# EAGLE design keyBoard_B (EAGLE 6.3)
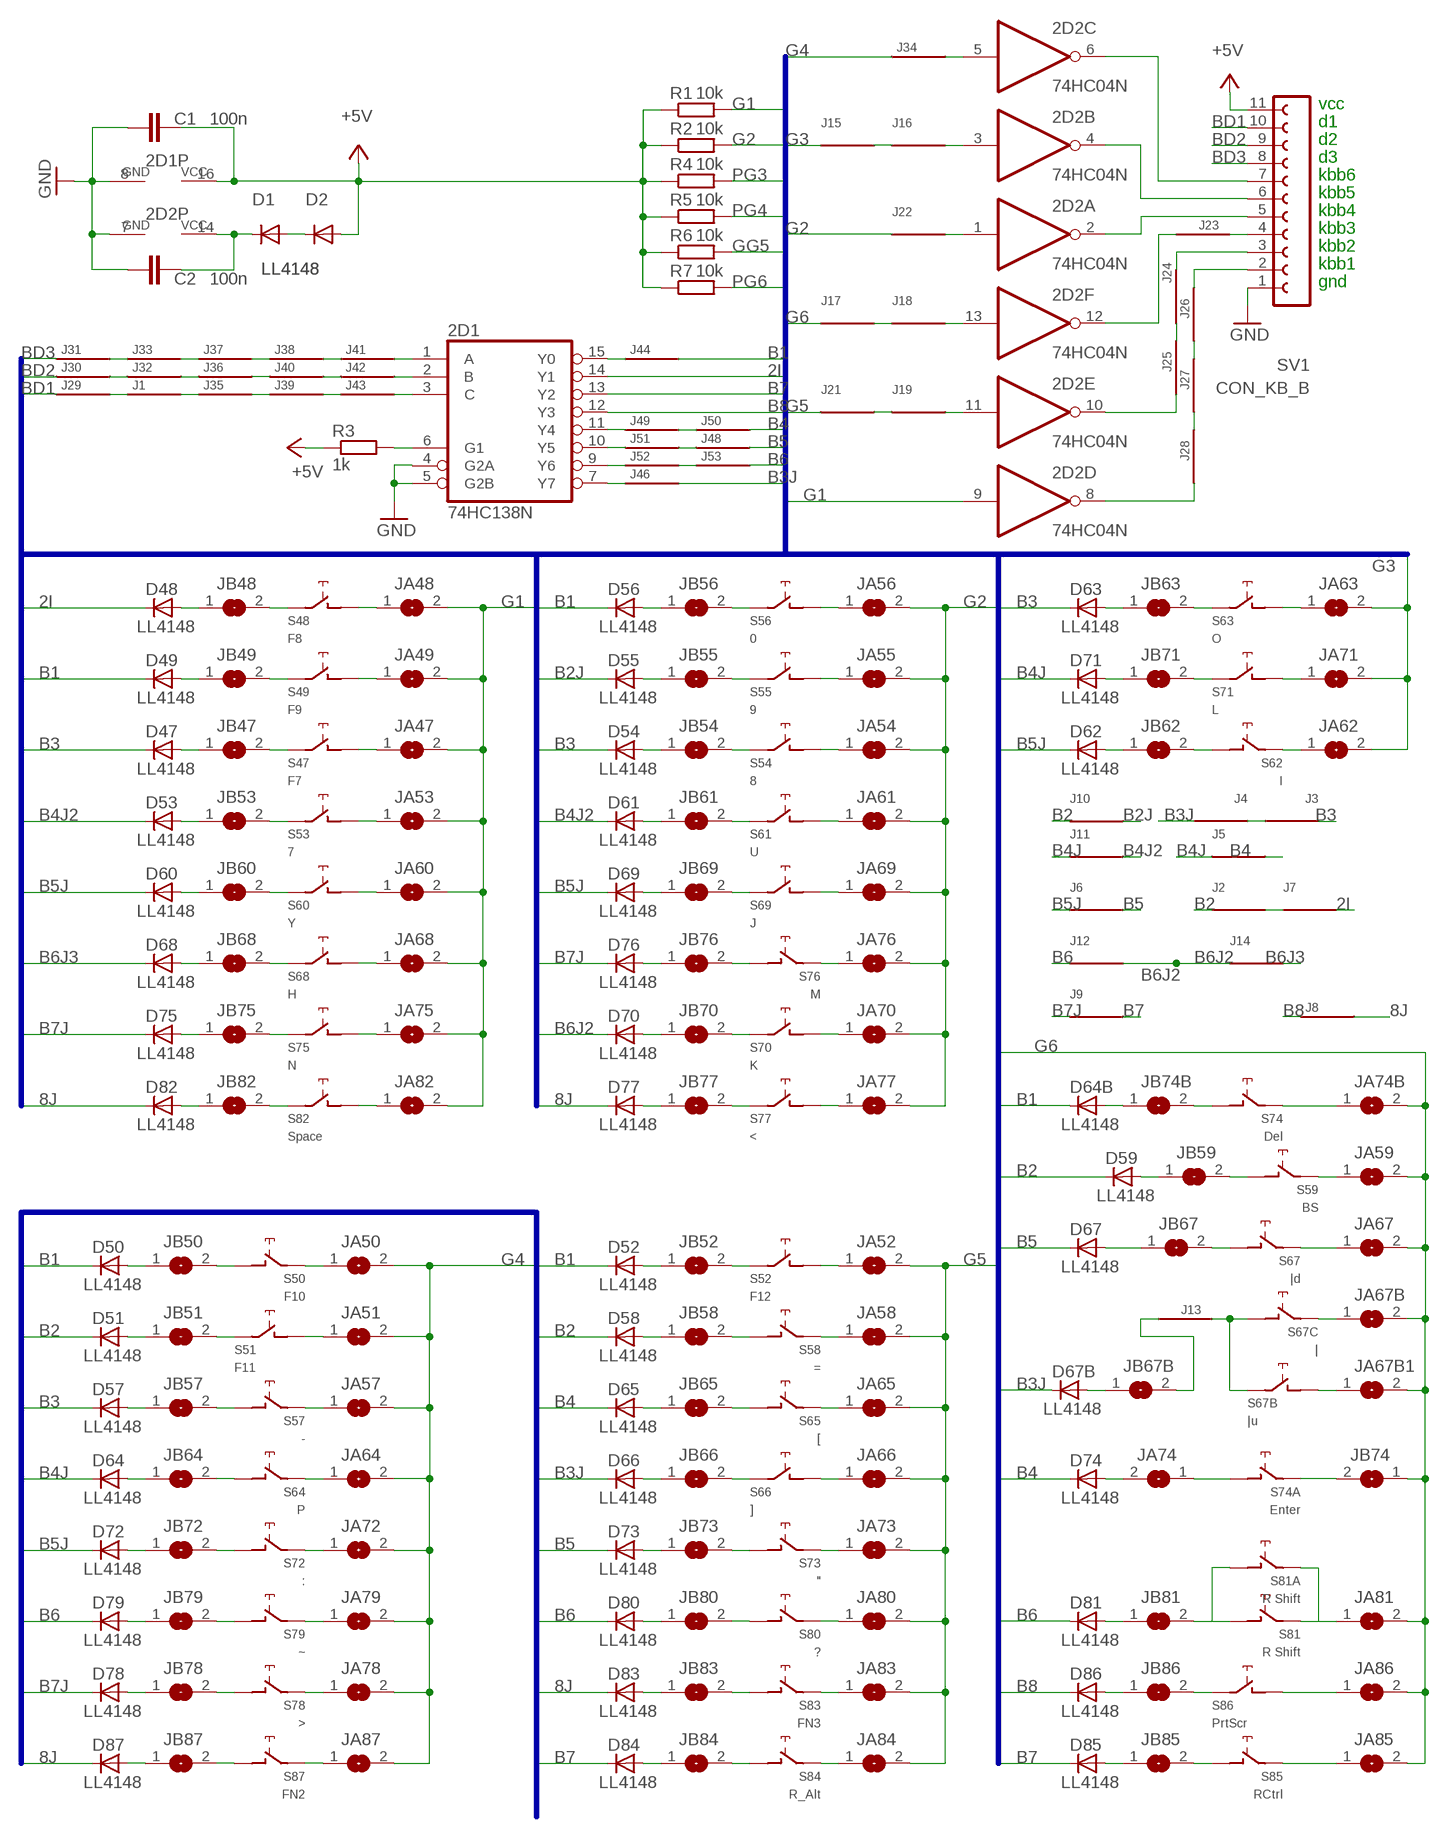
[diagram p0: schematic, sheet 1]

## Parts
2D1  74HC138N  74AC138N  [DIL16]
2D2  74HC04N  74ALS04N  [DIL14]
C1  100n  C-EUC0805  [C0805]
C2  100n  C-EUC1206  [C1206]
D1  LL4148  [SOD80C]
D2  LL4148  [SOD80C]
D47  LL4148  [SOD80C]
D48  LL4148  [SOD80C]
D49  LL4148  [SOD80C]
D50  LL4148  [SOD80C]
D51  LL4148  [SOD80C]
D52  LL4148  [SOD80C]
D53  LL4148  [SOD80C]
D54  LL4148  [SOD80C]
D55  LL4148  [SOD80C]
D56  LL4148  [SOD80C]
D57  LL4148  [SOD80C]
D58  LL4148  [SOD80C]
D59  LL4148  [SOD80C]
D60  LL4148  [SOD80C]
D61  LL4148  [SOD80C]
D62  LL4148  [SOD80C]
D63  LL4148  [SOD80C]
D64  LL4148  [SOD80C]
D64B  LL4148  [SOD80C]
D65  LL4148  [SOD80C]
D66  LL4148  [SOD80C]
D67  LL4148  [SOD80C]
D67B  LL4148  [SOD80C]
D68  LL4148  [SOD80C]
D69  LL4148  [SOD80C]
D70  LL4148  [SOD80C]
D71  LL4148  [SOD80C]
D72  LL4148  [SOD80C]
D73  LL4148  [SOD80C]
D74  LL4148  [SOD80C]
D75  LL4148  [SOD80C]
D76  LL4148  [SOD80C]
D77  LL4148  [SOD80C]
D78  LL4148  [SOD80C]
D79  LL4148  [SOD80C]
D80  LL4148  [SOD80C]
D81  LL4148  [SOD80C]
D82  LL4148  [SOD80C]
D83  LL4148  [SOD80C]
D84  LL4148  [SOD80C]
D85  LL4148  [SOD80C]
D86  LL4148  [SOD80C]
D87  LL4148  [SOD80C]
J1  J  [R1206W]
J2  J  [R1206W]
J3  J  [R1206W]
J4  J  [R1206W]
J5  J  [R1206W]
J6  J  [R1206W]
J7  J  [R1206W]
J8  J  [R1206W]
J9  J  [R1206W]
J10  J  [R1206W]
J11  J  [R1206W]
J12  J  [R1206W]
J13  J  [R1206W]
J14  J  [R1206W]
J15  J  [R1206W]
J16  J  [R1206W]
J17  J  [R1206W]
J18  J  [R1206W]
J19  J  [R1206W]
J21  J  [R1206W]
J22  J  [R1206W]
J23  J  [R1206W]
J24  J  [R1206W]
J25  J  [R1206W]
J26  J  [R1206W]
J27  J  [R1206W]
J28  J  [R1206W]
J29  J  [R1206W]
J30  J  [R1206W]
J31  J  [R1206W]
J32  J  [R1206W]
J33  J  [R1206W]
J34  J  [R1206W]
J35  J  [R1206W]
J36  J  [R1206W]
J37  J  [R1206W]
J38  J  [R1206W]
J39  J  [R1206W]
J40  J  [R1206W]
J41  J  [R1206W]
J42  J  [R1206W]
J43  J  [R1206W]
J44  J  [R1206W]
J46  J  [R1206W]
J48  J  [R1206W]
J49  J  [R1206W]
J50  J  [R1206W]
J51  J  [R1206W]
J52  J  [R1206W]
J53  J  [R1206W]
JA47  SJ  [SJ]
JA48  SJ  [SJ]
JA49  SJ  [SJ]
JA50  SJ  [SJ]
JA51  SJ  [SJ]
JA52  SJ  [SJ]
JA53  SJ  [SJ]
JA54  SJ  [SJ]
JA55  SJ  [SJ]
JA56  SJ  [SJ]
JA57  SJ  [SJ]
JA58  SJ  [SJ]
JA59  SJ  [SJ]
JA60  SJ  [SJ]
JA61  SJ  [SJ]
JA62  SJ  [SJ]
JA63  SJ  [SJ]
JA64  SJ  [SJ]
JA65  SJ  [SJ]
JA66  SJ  [SJ]
JA67  SJ  [SJ]
JA67B  SJ  [SJ]
JA67B1  SJ  [SJ]
JA68  SJ  [SJ]
JA69  SJ  [SJ]
JA70  SJ  [SJ]
JA71  SJ  [SJ]
JA72  SJ  [SJ]
JA73  SJ  [SJ]
JA74  SJ  [SJ]
JA74B  SJ  [SJ]
JA75  SJ  [SJ]
JA76  SJ  [SJ]
JA77  SJ  [SJ]
JA78  SJ  [SJ]
JA79  SJ  [SJ]
JA80  SJ  [SJ]
JA81  SJ  [SJ]
JA82  SJ  [SJ]
JA83  SJ  [SJ]
JA84  SJ  [SJ]
JA85  SJ  [SJ]
JA86  SJ  [SJ]
JA87  SJ  [SJ]
JB47  SJ  [SJ]
JB48  SJ  [SJ]
JB49  SJ  [SJ]
JB50  SJ  [SJ]
JB51  SJ  [SJ]
JB52  SJ  [SJ]
JB53  SJ  [SJ]
JB54  SJ  [SJ]
JB55  SJ  [SJ]
JB56  SJ  [SJ]
JB57  SJ  [SJ]
JB58  SJ  [SJ]
JB59  SJ  [SJ]
JB60  SJ  [SJ]
JB61  SJ  [SJ]
JB62  SJ  [SJ]
JB63  SJ  [SJ]
JB64  SJ  [SJ]
JB65  SJ  [SJ]
JB66  SJ  [SJ]
JB67  SJ  [SJ]
JB67B  SJ  [SJ]
JB68  SJ  [SJ]
JB69  SJ  [SJ]
JB70  SJ  [SJ]
JB71  SJ  [SJ]
JB72  SJ  [SJ]
JB73  SJ  [SJ]
JB74  SJ  [SJ]
JB74B  SJ  [SJ]
JB75  SJ  [SJ]
JB76  SJ  [SJ]
JB77  SJ  [SJ]
JB78  SJ  [SJ]
JB79  SJ  [SJ]
JB80  SJ  [SJ]
JB81  SJ  [SJ]
JB82  SJ  [SJ]
JB83  SJ  [SJ]
JB84  SJ  [SJ]
JB85  SJ  [SJ]
JB86  SJ  [SJ]
JB87  SJ  [SJ]
R1  10k  R-EU_R0805  [R0805]
R2  10k  R-EU_R0805  [R0805]
R3  1k  R-EU_R0805  [R0805]
R4  10k  R-EU_R0805  [R0805]
R5  10k  R-EU_R1206W  [R1206W]
R6  10k  R-EU_R0805  [R0805]
R7  10k  R-EU_R0805  [R0805]
S47  F7  CHERRY-MX-4P  [CHERRY-MX-4P]
S48  F8  CHERRY-MX-4P  [CHERRY-MX-4P]
S49  F9  CHERRY-MX-4P  [CHERRY-MX-4P]
S50  F10  CHERRY-MX-4P  [CHERRY-MX-4P]
S51  F11  CHERRY-MX-4P  [CHERRY-MX-4P]
S52  F12  CHERRY-MX-4P  [CHERRY-MX-4P]
S53  7  CHERRY-MX-4P  [CHERRY-MX-4P]
S54  8  CHERRY-MX-4P  [CHERRY-MX-4P]
S55  9  CHERRY-MX-4P  [CHERRY-MX-4P]
S56  0  CHERRY-MX-4P  [CHERRY-MX-4P]
S57  -  CHERRY-MX-4P  [CHERRY-MX-4P]
S58  =  CHERRY-MX-4P  [CHERRY-MX-4P]
S59  BS  CHERRY-MX-4P  [CHERRY-MX-4P]
S60  Y  CHERRY-MX-4P  [CHERRY-MX-4P]
S61  U  CHERRY-MX-4P  [CHERRY-MX-4P]
S62  I  CHERRY-MX-4P  [CHERRY-MX-4P]
S63  O  CHERRY-MX-4P  [CHERRY-MX-4P]
S64  P  CHERRY-MX-4P  [CHERRY-MX-4P]
S65  [  CHERRY-MX-4P  [CHERRY-MX-4P]
S66  ]  CHERRY-MX-4P  [CHERRY-MX-4P]
S67  |d  CHERRY-MX-4P  [CHERRY-MX-4P]
S67B  |u  CHERRY-MX  [CHERRY-MX]
S67C  |  CHERRY-MX-4P  [CHERRY-MX-4P]
S68  H  CHERRY-MX-4P  [CHERRY-MX-4P]
S69  J  CHERRY-MX-4P  [CHERRY-MX-4P]
S70  K  CHERRY-MX-4P  [CHERRY-MX-4P]
S71  L  CHERRY-MX-4P  [CHERRY-MX-4P]
S72  :  CHERRY-MX-4P  [CHERRY-MX-4P]
S73  "  CHERRY-MX-4P  [CHERRY-MX-4P]
S74  Del  CHERRY-MX-4P  [CHERRY-MX-4P]
S74A  Enter  CHERRY-MX-4P  [CHERRY-MX-4P]
S75  N  CHERRY-MX-4P  [CHERRY-MX-4P]
S76  M  CHERRY-MX-4P  [CHERRY-MX-4P]
S77  <  CHERRY-MX-4P  [CHERRY-MX-4P]
S78  >  CHERRY-MX-4P  [CHERRY-MX-4P]
S79  ~  CHERRY-MX-4P  [CHERRY-MX-4P]
S80  ?  CHERRY-MX-4P  [CHERRY-MX-4P]
S81  R Shift  CHERRY-MX-4P  [CHERRY-MX-4P]
S81A  R Shift  CHERRY-MX-4P  [CHERRY-MX-4P]
S82  Space  CHERRY-MX-4P  [CHERRY-MX-4P]
S83  FN3  CHERRY-MX-4P  [CHERRY-MX-4P]
S84  R_Alt  CHERRY-MX-4P  [CHERRY-MX-4P]
S85  RCtrl  CHERRY-MX-4P  [CHERRY-MX-4P]
S86  PrtScr  CHERRY-MX-4P  [CHERRY-MX-4P]
S87  FN2  CHERRY-MX-4P  [CHERRY-MX-4P]
SV1  CON_KB_B  FE12-1  [FE12]

## Nets
2I: 2D1.14(Y1) D48.C J7.1
8J: D77.C D82.C D83.C D87.C J8.1
+3VD: 2D2.14(P:VCC) C2.1 D1.C
+5V_B: 2D1.16(VCC) C1.1 D2.A R1.1 R2.1 R3.1 R4.1 R5.1 R6.1 R7.1 SV1.11 ; supply symbol labelled +5V
B1: D49.C D50.C D52.C D56.C D64B.C J44.1
B2: D51.C D58.C D59.C J2.2 J10.2
B2J: D55.C J10.1
B3: D47.C D54.C D57.C D63.C J3.2
B3J: D66.C D67B.C J4.1 J46.1
B4: D65.C D74.C J5.1 J50.1
B4J: D64.C D71.C J5.2 J11.2
B4J2: D53.C D61.C J11.1
B5: D67.C D73.C J6.1 J48.1
B5J: D60.C D62.C D69.C D72.C J6.2
B6: D79.C D80.C D81.C J12.2 J53.1
B6J2: D70.C J12.1 J14.2
B6J3: D68.C J14.1
B7: 2D1.13(Y2) D84.C D85.C J9.1
B7J: D75.C D76.C D78.C J9.2
B8: 2D1.12(Y3) D86.C J8.2
BD1: J29.2 SV1.10
BD2: J30.2 SV1.9
BD3: J31.2 SV1.8
G1: 2D2.9(D:I) JA47.2 JA48.2 JA49.2 JA53.2 JA60.2 JA68.2 JA75.2 JA82.2 R1.2
G2: J22.2 JA54.2 JA55.2 JA56.2 JA61.2 JA69.2 JA70.2 JA76.2 JA77.2 R2.2
G3: J15.2 JA62.2 JA63.2 JA71.2
G4: J34.2 JA50.2 JA51.2 JA57.2 JA64.2 JA72.2 JA78.2 JA79.2 JA87.2
G5: J21.2 JA52.2 JA58.2 JA65.2 JA66.2 JA73.2 JA80.2 JA83.2 JA84.2
G6: J17.2 JA59.2 JA67.2 JA67B1.2 JA67B.2 JA74B.2 JA81.2 JA85.2 JA86.2 JB74.1
GG5: 2D2.11(E:I) J19.1 R6.2
GND_B: 2D1.4(G2A) 2D1.5(G2B) 2D1.8(GND) 2D2.7(P:GND) C1.2 C2.2 SV1.1 ; supply symbol labelled GND
N$1: 2D2.1(A:I) J22.1
N$2: J23.1 SV1.4
N$3: 2D2.10(E:O) J25.2
N$4: J24.1 SV1.3
N$5: J24.2 J25.1
N$6: J26.2 J27.1
N$7: J26.1 SV1.2
N$8: J27.2 J28.1
N$10: D1.A D2.C
N$11: J1.2 J29.1
N$12: J30.1 J32.2
N$13: J31.1 J33.2
N$14: J1.1 J35.2
N$15: J32.1 J36.2
N$16: J33.1 J37.2
N$17: J13.2 JB67B.2
N$18: J37.1 J38.2
N$19: J36.1 J40.2
N$20: J35.1 J39.2
N$21: J38.1 J41.2
N$22: J40.1 J42.2
N$23: J39.1 J43.2
N$24: 2D1.1(A) J41.1
N$25: 2D1.2(B) J42.1
N$26: 2D1.3(C) J43.1
N$27: 2D1.15(Y0) J44.2
N$28: JB86.2 S86.SW1(PIN-1)
N$29: JA86.1 S86.SW2(PIN-2)
N$32: 2D1.7(Y7) J46.2
N$33: J48.2 J51.1
N$34: 2D1.9(Y6) J52.2
N$35: 2D1.11(Y4) J49.2
N$36: J49.1 J50.2
N$37: 2D1.10(Y5) J51.2
N$39: J52.1 J53.2
N$51: JA67B.1 S67C.SW1(PIN-1)
N$55: J2.1 J7.2
N$60: JA67B1.1 S67B.SW2(PIN-2)
N$67: 2D2.6(C:O) SV1.7
N$70: JB74B.2 S74.SW2(PIN-2)
N$71: JB52.2 S52.SW1(PIN-1)
N$84: JB63.2 S63.SW1(PIN-1)
N$89: JB73.2 S73.SW2(PIN-2)
N$94: JB74.2 S74A.SW1(PIN-1)
N$97: JA74.1 S74A.SW2(PIN-2)
N$112: JB47.2 S47.SW1(PIN-1)
N$127: JB53.2 S53.SW1(PIN-1)
N$152: J17.1 J18.2
N$153: JB60.2 S60.SW1(PIN-1)
N$154: JB68.2 S68.SW1(PIN-1)
N$155: JB75.2 S75.SW1(PIN-1)
N$156: JB82.2 S82.SW1(PIN-1)
N$157: JB48.2 S48.SW1(PIN-1)
N$158: JB54.2 S54.SW1(PIN-1)
N$159: JB61.2 S61.SW1(PIN-1)
N$160: JB69.2 S69.SW1(PIN-1)
N$161: JB76.2 S76.SW2(PIN-2)
N$162: JB83.2 S83.SW2(PIN-2)
N$163: JB49.2 S49.SW1(PIN-1)
N$164: JB55.2 S55.SW1(PIN-1)
N$165: JB62.2 S62.SW2(PIN-2)
N$166: JB70.2 S70.SW1(PIN-1)
N$167: JB77.2 S77.SW1(PIN-1)
N$168: JA73.1 S73.SW1(PIN-1)
N$169: JB50.2 S50.SW2(PIN-2)
N$170: JB56.2 S56.SW1(PIN-1)
N$171: JB71.2 S71.SW1(PIN-1)
N$172: JB78.2 S78.SW2(PIN-2)
N$173: JB85.2 S85.SW2(PIN-2)
N$174: JB51.2 S51.SW1(PIN-1)
N$175: JB57.2 S57.SW2(PIN-2)
N$176: JA57.1 S57.SW1(PIN-1)
N$177: JA64.1 S64.SW1(PIN-1)
N$178: JB79.2 S79.SW2(PIN-2)
N$180: JB58.2 S58.SW2(PIN-2)
N$181: JB65.2 S65.SW2(PIN-2)
N$182: JA80.1 S80.SW1(PIN-1)
N$183: JB59.2 S59.SW2(PIN-2)
N$184: JB66.2 S66.SW1(PIN-1)
N$185: JB67.2 S67.SW2(PIN-2)
N$186: JB81.2 S81.SW2(PIN-2) S81A.SW2(PIN-2)
N$187: D47.A JB47.1
N$188: D53.A JB53.1
N$189: D60.A JB60.1
N$190: D68.A JB68.1
N$191: D75.A JB75.1
N$192: D82.A JB82.1
N$193: D48.A JB48.1
N$194: D54.A JB54.1
N$195: D61.A JB61.1
N$196: D69.A JB69.1
N$197: D76.A JB76.1
N$198: D83.A JB83.1
N$199: D49.A JB49.1
N$200: D55.A JB55.1
N$201: D62.A JB62.1
N$202: D70.A JB70.1
N$203: D77.A JB77.1
N$204: D84.A JB84.1
N$205: D50.A JB50.1
N$206: D56.A JB56.1
N$207: D63.A JB63.1
N$208: D71.A JB71.1
N$209: D78.A JB78.1
N$210: D85.A JB85.1
N$211: D51.A JB51.1
N$212: D57.A JB57.1
N$213: D64.A JB64.1
N$214: D72.A JB72.1
N$215: D79.A JB79.1
N$216: D86.A JB86.1
N$217: D52.A JB52.1
N$218: D58.A JB58.1
N$219: D65.A JB65.1
N$220: D73.A JB73.1
N$221: D80.A JB80.1
N$222: D59.A JB59.1
N$223: D66.A JB66.1
N$224: D67.A JB67.1
N$225: D74.A JA74.2
N$226: D81.A JB81.1
N$227: JA66.1 S66.SW2(PIN-2)
N$228: JA47.1 S47.SW2(PIN-2)
N$229: JA53.1 S53.SW2(PIN-2)
N$230: JA60.1 S60.SW2(PIN-2)
N$231: JA68.1 S68.SW2(PIN-2)
N$232: JA75.1 S75.SW2(PIN-2)
N$233: JA82.1 S82.SW2(PIN-2)
N$234: JA48.1 S48.SW2(PIN-2)
N$235: JA54.1 S54.SW2(PIN-2)
N$236: JA61.1 S61.SW2(PIN-2)
N$237: JA69.1 S69.SW2(PIN-2)
N$238: JA76.1 S76.SW1(PIN-1)
N$239: JA83.1 S83.SW1(PIN-1)
N$240: JA49.1 S49.SW2(PIN-2)
N$241: JA55.1 S55.SW2(PIN-2)
N$242: JA62.1 S62.SW1(PIN-1)
N$243: JA70.1 S70.SW2(PIN-2)
N$244: JA77.1 S77.SW2(PIN-2)
N$245: JB80.2 S80.SW2(PIN-2)
N$246: JA50.1 S50.SW1(PIN-1)
N$247: JA56.1 S56.SW2(PIN-2)
N$248: JA63.1 S63.SW2(PIN-2)
N$249: JA71.1 S71.SW2(PIN-2)
N$250: JA78.1 S78.SW1(PIN-1)
N$251: JA85.1 S85.SW1(PIN-1)
N$252: JA51.1 S51.SW2(PIN-2)
N$253: JB64.2 S64.SW2(PIN-2)
N$254: JB72.2 S72.SW2(PIN-2)
N$255: JA72.1 S72.SW1(PIN-1)
N$256: JA79.1 S79.SW1(PIN-1)
N$258: JA52.1 S52.SW2(PIN-2)
N$259: JA65.1 S65.SW1(PIN-1)
N$260: JA58.1 S58.SW1(PIN-1)
N$261: JB84.2 S84.SW2(PIN-2)
N$262: JA84.1 S84.SW1(PIN-1)
N$263: JA81.1 S81.SW1(PIN-1) S81A.SW1(PIN-1)
N$264: JA67.1 S67.SW1(PIN-1)
N$265: JA59.1 S59.SW1(PIN-1)
N$266: D64B.A JB74B.1
N$267: JA74B.1 S74.SW1(PIN-1)
N$268: 2D2.4(B:O) SV1.6
N$269: J3.1 J4.2
N$270: 2D2.2(A:O) SV1.5
N$271: J13.1 S67B.SW1(PIN-1) S67C.SW2(PIN-2)
N$275: 2D2.12(F:O) J23.2
N$277: 2D1.6(G1) R3.2
N$281: 2D2.8(D:O) J28.2
N$282: D67B.A JB67B.1
N$285: J15.1 J16.2
N$286: JA87.1 S87.SW1(PIN-1)
N$287: JB87.2 S87.SW2(PIN-2)
N$288: D87.A JB87.1
PG3: 2D2.3(B:I) J16.1 R4.2
PG4: 2D2.5(C:I) J34.1 R5.2
PG5: J19.2 J21.1
PG6: 2D2.13(F:I) J18.1 R7.2
Unconnected: S47.D1(_D:D1) S47.D2(_D:D2) S47.LED1(_L:LED1) S47.LED2(_L:LED2) S48.D1(_D:D1) S48.D2(_D:D2) S48.LED1(_L:LED1) S48.LED2(_L:LED2) S49.D1(_D:D1) S49.D2(_D:D2) S49.LED1(_L:LED1) S49.LED2(_L:LED2) S50.D1(_D:D1) S50.D2(_D:D2) S50.LED1(_L:LED1) S50.LED2(_L:LED2) S51.D1(_D:D1) S51.D2(_D:D2) S51.LED1(_L:LED1) S51.LED2(_L:LED2) S52.D1(_D:D1) S52.D2(_D:D2) S52.LED1(_L:LED1) S52.LED2(_L:LED2) S53.D1(_D:D1) S53.D2(_D:D2) S53.LED1(_L:LED1) S53.LED2(_L:LED2) S54.D1(_D:D1) S54.D2(_D:D2) S54.LED1(_L:LED1) S54.LED2(_L:LED2) S55.D1(_D:D1) S55.D2(_D:D2) S55.LED1(_L:LED1) S55.LED2(_L:LED2) S56.D1(_D:D1) S56.D2(_D:D2) S56.LED1(_L:LED1) S56.LED2(_L:LED2) S57.D1(_D:D1) S57.D2(_D:D2) S57.LED1(_L:LED1) S57.LED2(_L:LED2) S58.D1(_D:D1) S58.D2(_D:D2) S58.LED1(_L:LED1) S58.LED2(_L:LED2) S59.D1(_D:D1) S59.D2(_D:D2) S59.LED1(_L:LED1) S59.LED2(_L:LED2) S60.D1(_D:D1) S60.D2(_D:D2) S60.LED1(_L:LED1) S60.LED2(_L:LED2) S61.D1(_D:D1) S61.D2(_D:D2) S61.LED1(_L:LED1) S61.LED2(_L:LED2) S62.D1(_D:D1) S62.D2(_D:D2) S62.LED1(_L:LED1) S62.LED2(_L:LED2) S63.D1(_D:D1) S63.D2(_D:D2) S63.LED1(_L:LED1) S63.LED2(_L:LED2) S64.D1(_D:D1) S64.D2(_D:D2) S64.LED1(_L:LED1) S64.LED2(_L:LED2) S65.D1(_D:D1) S65.D2(_D:D2) S65.LED1(_L:LED1) S65.LED2(_L:LED2) S66.D1(_D:D1) S66.D2(_D:D2) S66.LED1(_L:LED1) S66.LED2(_L:LED2) S67.D1(_D:D1) S67.D2(_D:D2) S67.LED1(_L:LED1) S67.LED2(_L:LED2) S67C.D1(_D:D1) S67C.D2(_D:D2) S67C.LED1(_L:LED1) S67C.LED2(_L:LED2) S68.D1(_D:D1) S68.D2(_D:D2) S68.LED1(_L:LED1) S68.LED2(_L:LED2) S69.D1(_D:D1) S69.D2(_D:D2) S69.LED1(_L:LED1) S69.LED2(_L:LED2) S70.D1(_D:D1) S70.D2(_D:D2) S70.LED1(_L:LED1) S70.LED2(_L:LED2) S71.D1(_D:D1) S71.D2(_D:D2) S71.LED1(_L:LED1) S71.LED2(_L:LED2) S72.D1(_D:D1) S72.D2(_D:D2) S72.LED1(_L:LED1) S72.LED2(_L:LED2) S73.D1(_D:D1) S73.D2(_D:D2) S73.LED1(_L:LED1) S73.LED2(_L:LED2) S74.D1(_D:D1) S74.D2(_D:D2) S74.LED1(_L:LED1) S74.LED2(_L:LED2) S74A.D1(_D:D1) S74A.D2(_D:D2) S74A.LED1(_L:LED1) S74A.LED2(_L:LED2) S75.D1(_D:D1) S75.D2(_D:D2) S75.LED1(_L:LED1) S75.LED2(_L:LED2) S76.D1(_D:D1) S76.D2(_D:D2) S76.LED1(_L:LED1) S76.LED2(_L:LED2) S77.D1(_D:D1) S77.D2(_D:D2) S77.LED1(_L:LED1) S77.LED2(_L:LED2) S78.D1(_D:D1) S78.D2(_D:D2) S78.LED1(_L:LED1) S78.LED2(_L:LED2) S79.D1(_D:D1) S79.D2(_D:D2) S79.LED1(_L:LED1) S79.LED2(_L:LED2) S80.D1(_D:D1) S80.D2(_D:D2) S80.LED1(_L:LED1) S80.LED2(_L:LED2) S81.D1(_D:D1) S81.D2(_D:D2) S81.LED1(_L:LED1) S81.LED2(_L:LED2) S81A.D1(_D:D1) S81A.D2(_D:D2) S81A.LED1(_L:LED1) S81A.LED2(_L:LED2) S82.D1(_D:D1) S82.D2(_D:D2) S82.LED1(_L:LED1) S82.LED2(_L:LED2) S83.D1(_D:D1) S83.D2(_D:D2) S83.LED1(_L:LED1) S83.LED2(_L:LED2) S84.D1(_D:D1) S84.D2(_D:D2) S84.LED1(_L:LED1) S84.LED2(_L:LED2) S85.D1(_D:D1) S85.D2(_D:D2) S85.LED1(_L:LED1) S85.LED2(_L:LED2) S86.D1(_D:D1) S86.D2(_D:D2) S86.LED1(_L:LED1) S86.LED2(_L:LED2) S87.D1(_D:D1) S87.D2(_D:D2) S87.LED1(_L:LED1) S87.LED2(_L:LED2)

## Buses
1,2,3,4,5,6,7,8,3J,4J,5J,6J,7J,8J,4J2,5J2,6J2,6J3,8J2,2I,2J,G[1..6],D[1..3]

## Notes on the sheet
- vcc
- d1
- d2
- d3
- kbb6
- kbb5
- kbb4
- kbb3
- kbb2
- kbb1
- gnd

## Library data of the parts
2D1 = detali2:74*138: 3-line to 8-line DECODER/DEMULTIPLEXER
2D2 = detali2:74*04: Hex INVERTER
C1 C2 = rcl:C-EU: CAPACITOR, European symbol
D1 D2 D47-D64 D64B D65-D67 D67B D68-D87 = detali:LL4148: DIODE high speed
J1-J19 J21-J44 J46 J48-J53 = detali2:J
JA47-JA67 JA67B JA67B1 JA68-JA74 JA74B JA75-JA87 JB47-JB67 JB67B JB68-JB74 JB74B JB75-JB87 = detali:SJ: SMD solder JUMPER
R1-R7 = rcl:R-EU_: RESISTOR, European symbol
S47-S67 S67C S68-S74 S74A S75-S81 S81A S82-S87 = cherrymx:CHERRY-MX-4P
S67B = cherrymx:CHERRY-MX: Cherry MX series keyswitch
SV1 = detali2:FE12-1: FEMALE HEADER; OC_FARNELL: unknown; OC_NEWARK: unknown

## Board
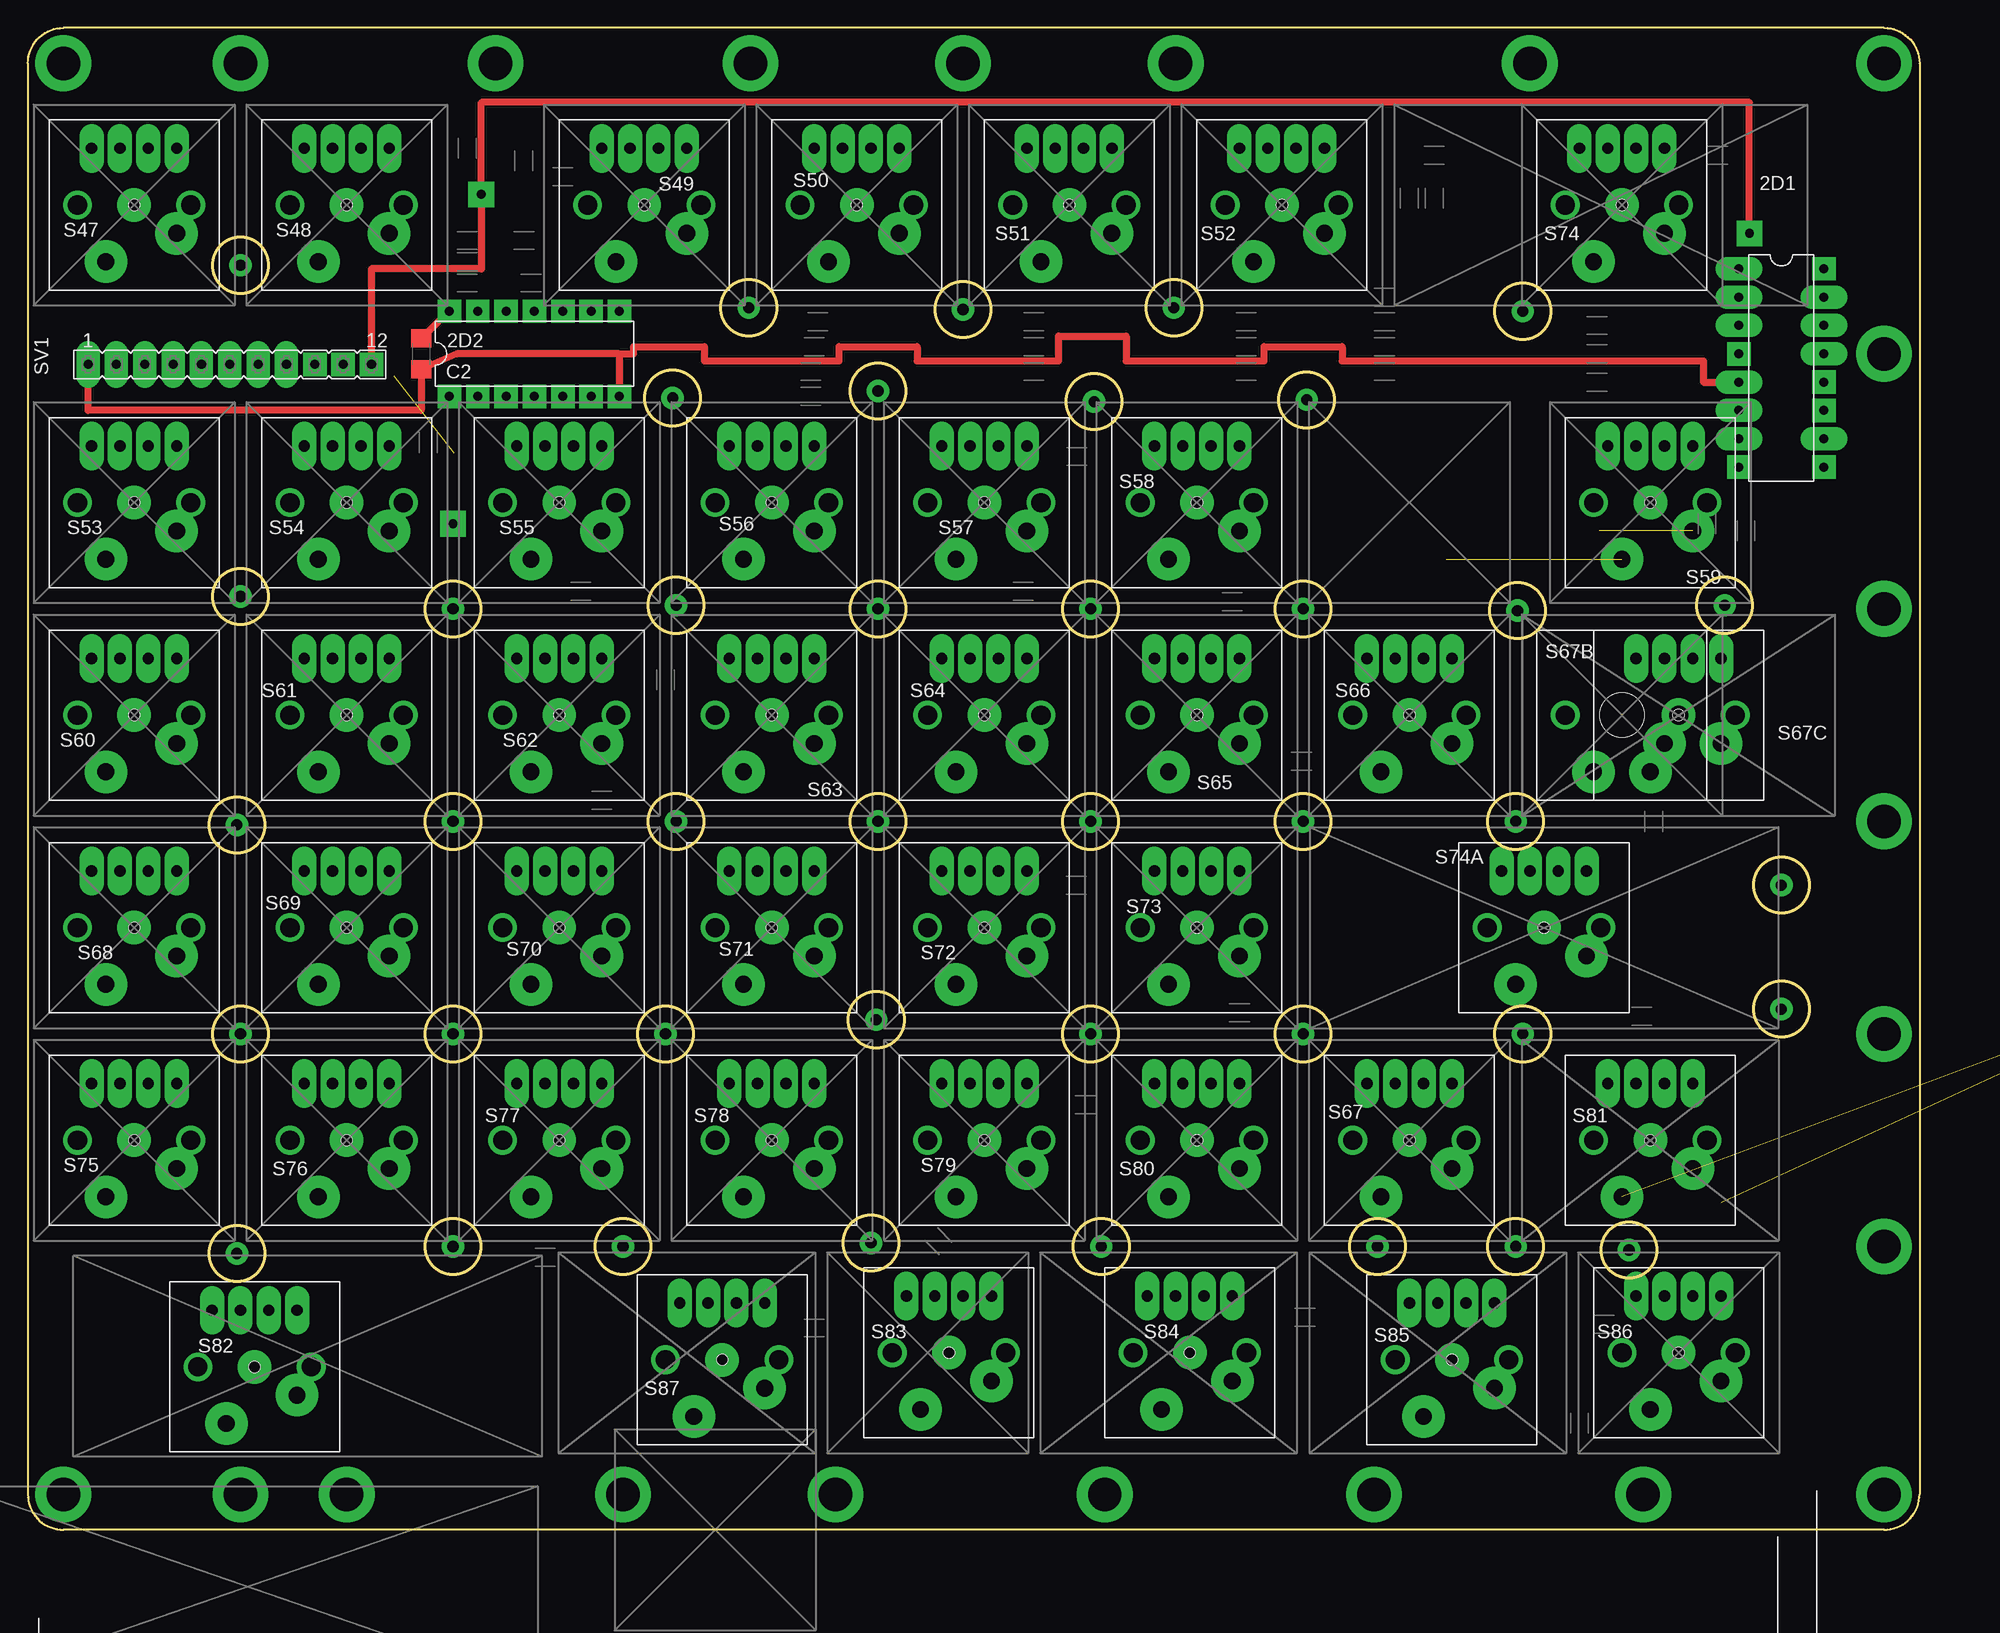
[diagram p1: board, top side]
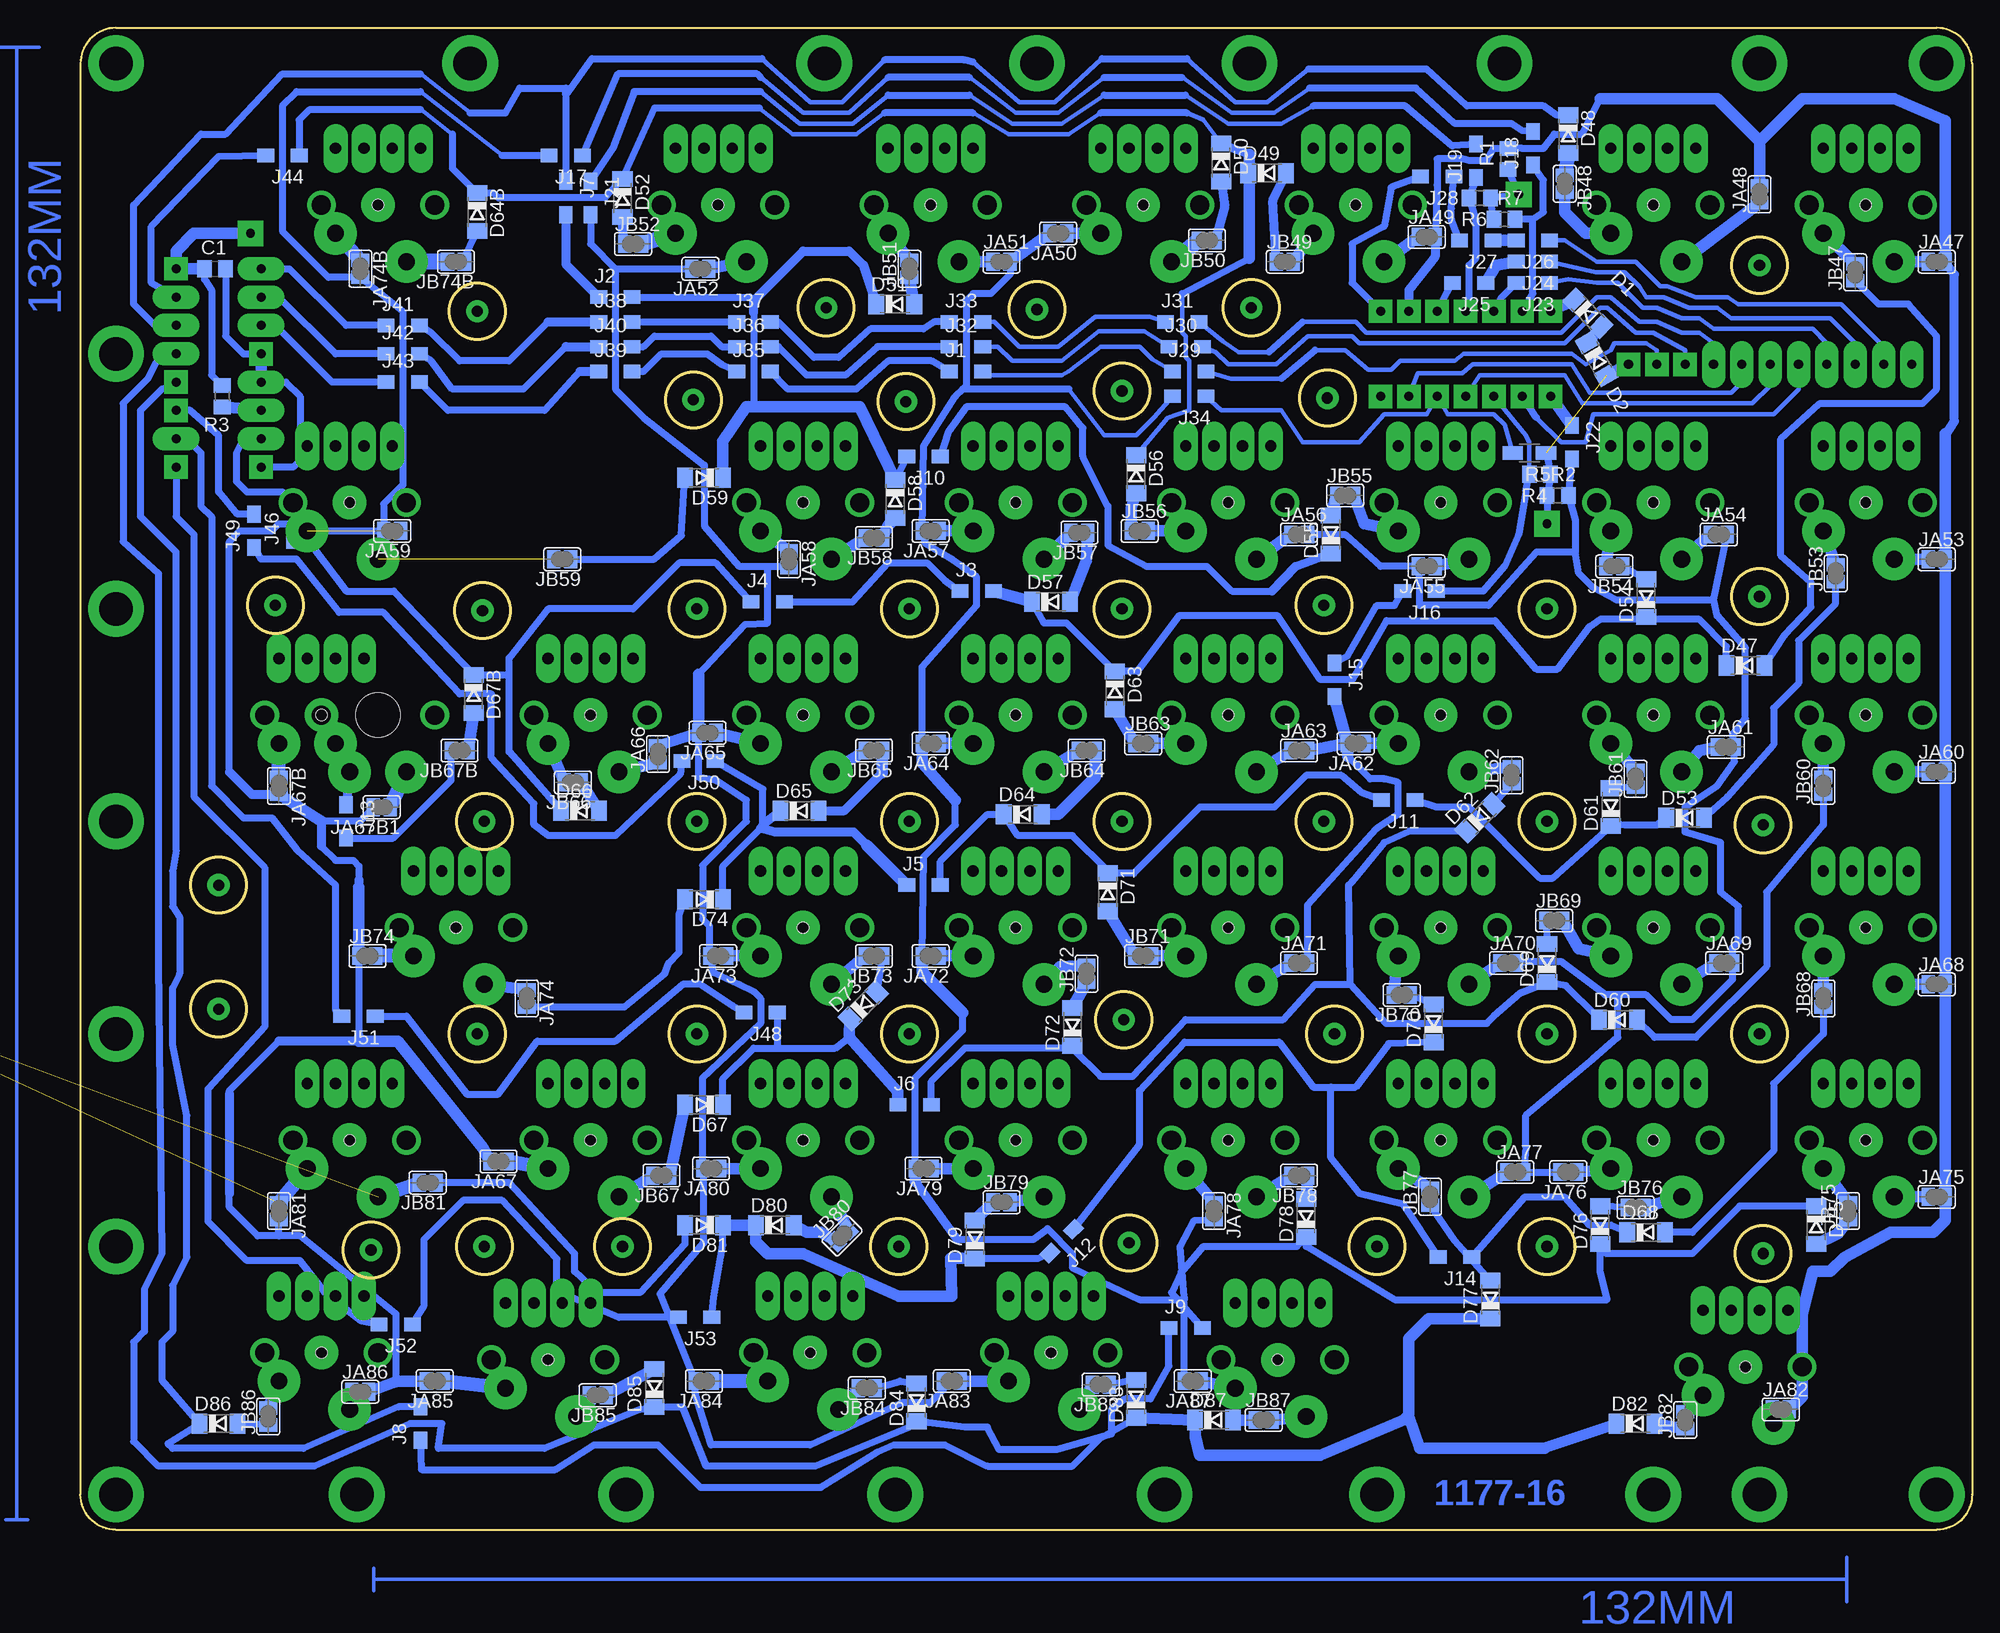
[diagram p2: board, bottom side, seen from below]

Size 169.54 x 134.62 mm. Coordinates in mm from the lower left corner, seen from the top.
Outline: 0,131.45 0,3.17 arc90 3.18,0 166.37,0 arc90 169.54,3.17 169.54,131.45 arc90 166.37,134.62 3.18,134.62 arc90 0,131.45
Outline: circle at 19.05,83.66 radius 2.5
Outline: circle at 38.1,82.55 radius 2.5
Outline: circle at 58.1,82.87 radius 2.5
Outline: circle at 18.73,63.18 radius 2.5
Outline: circle at 38.1,63.5 radius 2.5
Outline: circle at 58.1,63.5 radius 2.5
Outline: circle at 76.2,63.5 radius 2.5
Outline: circle at 76.2,82.55 radius 2.5
Outline: circle at 95.25,82.55 radius 2.5
Outline: circle at 95.25,63.5 radius 2.5
Outline: circle at 114.3,82.55 radius 2.5
Outline: circle at 114.3,63.5 radius 2.5
Outline: circle at 133.51,82.39 radius 2.5
Outline: circle at 133.35,63.5 radius 2.5
Outline: circle at 133.98,44.45 radius 2.5
Outline: circle at 133.35,25.4 radius 2.5
Outline: circle at 143.51,25.08 radius 2.5
Outline: circle at 64.61,109.54 radius 2.5
Outline: circle at 83.82,109.38 radius 2.5
Outline: circle at 102.71,109.54 radius 2.5
Copper layers (1*16): Top 0.035mm / dielectric 1.5mm / Bottom 0.035mm
Design rules "default": minimum track width 10mil, minimum drill 24mil, track to track 8mil, track to pad 8mil, pad to pad 8mil, via to via 8mil, smd to smd 8mil, copper to edge 40mil, drill to drill 8mil, minimum pad ring 10mil, minimum via ring 8mil, stop-mask expansion 4mil, vias tented up to drill 0mil, thermal gap 10mil

### Footprints (pad centres in the part's own frame; a part is rotated, then mirrored left to right if it is on the bottom)
DIL16 = drill 0.813 pad 2.1 long: 1 -8.89,-3.81; 2 -6.35,-3.81; 3 -3.81,-3.81; 5 1.27,-3.81; 6 3.81,-3.81; 7 6.35,-3.81; 10 6.35,3.81; 13 -1.27,3.81; 14 -3.81,3.81; 15 -6.35,3.81 | drill 0.813 pad 2.1 square: 4 -1.27,-3.81; 8 8.89,-3.81; 9 8.89,3.81; 11 3.81,3.81; 12 1.27,3.81; 16 -8.89,3.81
DIL14 = drill 0.813 pad 2.1 square: 1 -7.62,-3.81; 2 -5.08,-3.81; 3 -2.54,-3.81; 4 0,-3.81; 5 2.54,-3.81; 6 5.08,-3.81; 7 7.62,-3.81; 8 7.62,3.81; 9 5.08,3.81; 10 2.54,3.81; 11 0,3.81; 12 -2.54,3.81; 13 -5.08,3.81; 14 -7.62,3.81
C0805 = smd 1.3 x 1.5: 1 -0.95,0; 2 0.95,0
C1206 = smd 1.6 x 1.8: 1 -1.4,0; 2 1.4,0
SOD80C = smd 1.4 x 1.8 bottom: A -1.7,0; C 1.7,0
R1206W = smd 1.5 x 1.2 bottom: 1 1.499,0; 2 -1.499,0
SJ = smd 1.168 x 1.6 bottom: 1 0.762,0; 2 -0.762,0
R0805 = smd 1.3 x 1.5: 1 -0.95,0; 2 0.95,0
R1206W' = smd 1.8 x 1.2: 1 -1.499,0; 2 1.499,0
CHERRY-MX-4P = drill 1.016 pad 2.184 long: D1 -3.81,-5.08; D2 3.81,-5.08; LED1 -1.27,-5.08; LED2 1.27,-5.08 | drill 1 pad 3: P$1 0,0 | drill 1.714 pad 1.93: P$3 -5.08,0; P$4 5.08,0 | drill 1.5 pad 3.81: SW1 -3.81,2.54; SW2 2.54,5.08 | hole 1: 0,0
CHERRY-MX = drill 0.8: P$1 0,0 | drill 1.714 pad 1.93: P$3 -5.08,0; P$4 5.08,0 | drill 1.5 pad 3.81: SW1 -3.81,2.54; SW2 2.54,5.08 | hole 4: 0,0
FE12 = drill 0.813 pad 2.1 long: 1 -13.97,0; 2 -11.43,0; 3 -8.89,0; 4 -6.35,0; 5 -3.81,0; 6 -1.27,0; 7 1.27,0; 8 3.81,0 | drill 0.813 pad 2.1 square: 9 6.35,0; 10 8.89,0; 11 11.43,0

### Placement (x,y rotation side)
2D1  157.16,104.14 270 top
2D2  45.4,105.41 0 top
C1  157.48,113.03 0 bottom
C2  35.24,105.41 270 top
D1  34.45,109.06 45 top
D2  33.66,104.93 60 top
D47  20.32,77.47 0 top
D48  36.2,125.1 90 top
D49  63.18,121.6 0 top
D50  67.31,122.55 90 top
D51  96.52,109.86 0 top
D52  120.97,119.38 90 top
D53  25.72,63.82 0 top
D54  29.21,83.5 270 top
D55  57.47,89.22 270 top
D56  74.93,94.62 90 top
D57  82.55,83.19 0 top
D58  96.52,92.39 90 top
D59  113.67,94.3 180 top
D60  31.75,45.72 0 top
D61  32.39,64.77 270 top
D62  44.13,63.82 315 top
D63  76.84,75.25 90 top
D64  85.09,64.14 0 top
D64B  133.98,118.11 90 top
D65  105.09,64.45 0 top
D66  124.78,64.45 0 top
D67  113.67,38.1 180 top
D67B  134.3,74.93 90 top
D68  29.21,26.67 0 top
D69  38.1,50.8 270 top
D70  48.26,45.4 270 top
D71  77.47,57.15 90 top
D72  80.65,45.08 270 top
D73  99.38,46.99 315 top
D74  113.67,56.52 180 top
D75  13.97,27.3 90 top
D76  33.34,27.3 270 top
D77  43.18,20.64 270 top
D78  59.69,27.94 270 top
D79  89.38,26.04 270 top
D80  107.31,27.3 0 top
D81  113.67,27.3 180 top
D82  30.16,9.52 0 top
D83  74.93,11.75 270 top
D84  94.62,11.43 270 top
D85  118.11,12.7 270 top
D86  157.16,9.52 0 top
D87  67.95,9.84 0 top
J1  90.17,103.82 0 top
J2  121.6,110.49 0 top
J3  89.22,84.14 0 top
J4  107.95,83.19 0 top
J5  93.98,57.78 0 top
J6  94.77,38.1 0 top
J7  126.05,119.38 90 top
J8  139.06,9.52 270 top
J9  70.48,18.1 0 top
J10  93.98,96.2 180 top
J11  51.44,65.41 180 top
J12  81.6,25.88 135 top
J13  145.73,63.5 90 top
J14  46.36,24.45 180 top
J15  57.15,76.2 90 top
J16  49.53,84.14 180 top
J17  126.05,123.19 180 top
J18  39.37,123.83 270 top
J19  44.45,122.71 270 top
J21  123.83,119.38 90 top
J22  35.88,97.47 90 top
J23  39.37,111.76 180 top
J24  39.37,113.67 180 top
J25  45.08,111.76 180 top
J26  39.37,115.57 180 top
J27  44.45,115.57 180 top
J28  47.94,121.29 180 top
J29  70.17,103.82 0 top
J30  70.48,106.05 0 top
J31  70.8,108.27 0 top
J32  90.17,106.05 0 top
J33  90.17,108.27 0 top
J34  70.17,101.6 180 top
J35  109.22,103.82 0 top
J36  109.22,106.05 0 top
J37  109.22,108.27 0 top
J38  121.6,108.27 0 top
J39  121.6,103.82 0 top
J40  121.6,106.05 0 top
J41  140.65,107.95 0 top
J42  140.65,105.41 0 top
J43  140.65,102.87 0 top
J44  151.45,123.19 180 top
J46  150.49,90.17 270 top
J48  108.59,46.36 180 top
J49  153.99,89.53 270 top
J50  114.14,68.9 180 top
J51  144.62,46.04 180 top
J52  141.29,18.41 180 top
J53  114.46,19.05 180 top
JA47  3.18,113.67 0 top
JA48  19.05,119.7 270 top
JA49  48.89,115.89 0 top
JA50  81.92,116.2 180 top
JA51  87,113.67 0 top
JA52  113.98,113.03 180 top
JA53  3.18,87 0 top
JA54  22.7,89.22 0 top
JA55  48.89,86.36 180 top
JA56  60.33,89.22 0 top
JA57  93.34,89.53 180 top
JA58  106.05,87 90 top
JA59  141.6,89.53 180 top
JA60  3.18,67.95 0 top
JA61  22.07,70.17 0 top
JA62  55.25,70.48 180 top
JA63  60.33,69.85 0 top
JA64  93.34,70.48 180 top
JA65  113.35,71.44 180 top
JA66  117.79,69.53 270 top
JA67  132.08,33.02 180 top
JA67B  151.76,66.67 90 top
JA67B1  142.56,64.77 180 top
JA68  3.18,48.89 0 top
JA69  22.23,50.8 0 top
JA70  41.59,50.8 0 top
JA71  60.33,50.8 0 top
JA72  93.34,51.44 180 top
JA73  112.4,51.44 180 top
JA74  129.54,47.62 90 top
JA74B  144.46,113.03 90 top
JA75  3.18,29.85 0 top
JA76  36.2,32.07 180 top
JA77  40.96,32.07 0 top
JA78  67.95,28.57 90 top
JA79  93.98,32.39 180 top
JA80  113.03,32.39 180 top
JA81  151.76,28.57 90 top
JA82  17.14,10.79 0 top
JA83  91.44,13.34 180 top
JA84  113.67,13.34 180 top
JA85  137.79,13.34 180 top
JA86  144.46,12.38 0 top
JA87  69.85,13.34 180 top
JB47  10.48,112.71 270 top
JB48  36.51,120.65 90 top
JB49  61.59,113.67 0 top
JB50  68.58,115.57 180 top
JB51  95.25,113.03 270 top
JB52  120.02,115.25 0 top
JB53  12.22,85.73 270 top
JB54  32.07,86.36 180 top
JB55  56.2,92.71 0 top
JB56  74.61,89.53 0 top
JB57  80.01,89.38 180 top
JB58  98.42,88.9 180 top
JB59  126.36,87 180 top
JB60  13.34,66.67 270 top
JB61  30.16,67.31 270 top
JB62  41.28,67.63 270 top
JB63  74.3,70.48 0 top
JB64  79.38,69.85 180 top
JB65  98.42,69.85 180 top
JB66  125.41,66.99 180 top
JB67  117.48,31.75 180 top
JB67B  135.57,69.85 180 top
JB68  13.34,47.62 270 top
JB69  37.47,54.61 0 top
JB70  51.12,47.94 180 top
JB71  74.3,51.44 0 top
JB72  79.38,49.85 270 top
JB73  98.42,51.44 180 top
JB74  143.83,51.44 0 top
JB74B  135.89,113.67 180 top
JB75  11.11,28.57 270 top
JB76  30.16,28.89 0 top
JB77  48.58,29.85 270 top
JB78  60.33,31.75 180 top
JB79  87,29.37 0 top
JB80  101.28,26.35 315 top
JB81  138.43,31.11 180 top
JB82  25.72,9.84 270 top
JB83  78.11,13.02 180 top
JB84  99.06,12.7 180 top
JB85  123.19,12.06 180 top
JB86  152.72,10.16 270 top
JB87  63.5,9.84 0 top
R1  41.59,122.87 90 bottom
R2  37.15,92.71 0 bottom
R3  156.84,101.6 270 bottom
R4  38.73,94.62 180 bottom
R5  10k  [R1206W']  39.69,96.52 180 bottom
R6  44.13,119.38 180 bottom
R7  41.91,117.48 0 bottom
S47  9.53,118.74 180 top
S48  28.57,118.74 180 top
S49  55.25,118.74 180 top
S50  74.3,118.74 180 top
S51  93.34,118.74 180 top
S52  112.4,118.74 180 top
S53  9.53,92.08 180 top
S54  28.57,92.08 180 top
S55  47.62,92.08 180 top
S56  66.67,92.08 180 top
S57  85.73,92.08 180 top
S58  104.78,92.08 180 top
S59  145.41,92.08 180 top
S60  9.53,73.03 180 top
S61  28.57,73.03 180 top
S62  47.62,73.03 180 top
S63  66.67,73.03 180 top
S64  85.73,73.03 180 top
S65  104.78,73.03 180 top
S66  123.83,73.03 180 top
S67  123.83,34.92 180 top
S67B  142.88,73.03 180 top
S67C  147.95,73.03 180 top
S68  9.53,53.98 180 top
S69  28.57,53.98 180 top
S70  47.62,53.98 180 top
S71  66.67,53.98 180 top
S72  85.73,53.98 180 top
S73  104.78,53.98 180 top
S74  142.88,118.74 180 top
S74A  135.89,53.98 180 top
S75  9.53,34.92 180 top
S76  28.57,34.92 180 top
S77  47.62,34.92 180 top
S78  66.67,34.92 180 top
S79  85.73,34.92 180 top
S80  104.78,34.92 180 top
S81  145.41,34.92 180 top
S81A  193.04,52.7 180 top  (outside the outline)
S82  20.32,14.61 180 top
S83  82.55,15.88 180 top
S84  104.14,15.88 180 top
S85  127.64,15.24 180 top
S86  147.95,15.88 180 top
S87  62.23,15.24 180 top
SV1  19.37,104.46 0 top
U$1  [SIZE132]  75.25,-4.45 90 top  (outside the outline)
U$2  [18X23]  145.41,34.92 0 top
U$3  [18X18]  141.6,74.3 0 top
U$4  [18X18]  60.33,1.27 0 top
U$5  [18X18]  122.55,93.34 0 top
U$6  [18X23]  198.12,94.62 0 top  (outside the outline)
U$7  [18X18]  144.14,93.34 0 top
U$8  [18X42]  25.08,15.56 180 top
U$47  [18X18]  8.25,120.02 0 top
U$48  [18X18]  27.31,120.02 0 top
U$49  [18X18]  92.08,120.02 0 top
U$50  [18X18]  53.97,120.02 0 top
U$51  [18X18]  73.03,120.02 0 top
U$52  [18X18]  111.12,120.02 0 top
U$53  [18X18]  8.25,93.34 0 top
U$54  [18X18]  27.31,93.34 0 top
U$55  [18X18]  46.36,93.34 0 top
U$56  [18X18]  65.41,93.34 0 top
U$57  [18X18]  84.45,93.34 0 top
U$58  [18X18]  103.51,93.34 0 top
U$59  [18X18]  8.25,74.3 0 top
U$60  [18X18]  27.31,74.3 0 top
U$61  [18X18]  46.36,74.3 0 top
U$62  [18X18]  65.41,74.3 0 top
U$63  [18X18]  84.45,74.3 0 top
U$64  [18X18]  103.51,74.3 0 top
U$65  [18X18]  122.55,74.3 0 top
U$66  [18X18]  141.6,74.3 0 top
U$67  [18X18]  8.25,55.25 0 top
U$68  [18X18]  27.31,55.25 0 top
U$69  [18X18]  46.36,55.25 0 top
U$70  [18X18]  65.41,55.25 0 top
U$71  [18X18]  84.45,55.25 0 top
U$72  [18X18]  103.51,55.25 0 top
U$73  [18X18]  8.25,36.19 0 top
U$74  [18X18]  27.31,36.19 0 top
U$75  [18X18]  46.36,36.19 0 top
U$76  [18X18]  65.41,36.19 0 top
U$77  [18X18]  84.45,36.19 0 top
U$78  [18X18]  103.51,36.19 0 top
U$79  [18X52]  19.68,-5.08 0 top  (outside the outline)
U$80  [18X37]  140.97,118.74 0 top
U$83  [18X18]  146.69,17.14 0 top
U$84  [18X23]  126.36,15.88 0 top
U$85  [18X23]  102.23,15.88 0 top
U$86  [18X23]  59.06,15.88 0 top
U$87  [18X42]  135.89,53.98 0 top
U$90  [18X18]  79.38,17.14 0 top
U$92  [18X28]  147.95,73.03 0 top
U$116  [18X18]  141.6,120.02 0 top
U$117  [18X18]  122.55,36.19 0 top
U$165  [SIZE132]  175.26,68.9 0 top  (outside the outline)

### Tracks (layer width: path | path; a pad name or v marks a point on that pad's centre or on a via)
2I
  Bottom 0.406: 77.99,131.88 82.23,127.95 85.41,127.95 89.54,131.56 | 70.37,131.88 66.04,127.95 63.18,127.95 59.48,130.92 | 97.47,131.76 101.28,127.95 104.14,127.95 108.47,131.88 | 134.62,127 139.07,130.49
  Bottom 0.61: 2D1.14 162.88,107.95 164.78,109.86 164.78,118.74 158.75,125.1 156.53,125.1 151.45,130.49 139.07,130.49 | D48.C 37.26,126.79 38.42,127.64 45.29,127.64 48.89,130.92 59.48,130.92 | 77.99,131.88 70.37,131.88 | 108.47,131.88 123.71,131.88 126.05,128.59 | 89.54,131.56 90.37,131.76 97.47,131.76 | 126.05,128.59 126.05,129.22 130.17,129.22 131.45,127 134.62,127 | 126.05,128.59 J7.1
8J
  Bottom 0.61: J8.1 138.98,5.4 127,5.4 123.51,7.62 117.79,7.62 113.98,3.81 103.19,3.81 98.11,6.99 96.63,7.62 92.07,7.62 88.26,5.72 80.65,5.72 78.1,8.25 D83.C
  Bottom 1.016: 50.9,9.86 58.42,6.67 69.21,6.67 69.65,8.37 D87.C D83.C | 50.9,9.86 50.48,10.16 49.53,7.3 38.42,7.3 | 38.31,7.3 38.42,7.3 | D82.C 38.42,7.3 | D77.C 48.69,18.94 50.48,17.15 50.48,10.27 50.9,9.86
+3VD
  Top 0.61: C2.1 2D2.14
  Bottom 1.016: D1.C 2D2.14
+5V_B  (via drill 0.8 pad 2.3)  (1 unrouted)
  Top 0.61: SV1.11 30.8,113.03 40.64,113.03 v40.64,119.7 40.64,127.95 154.3,127.95 v154.3,116.2
  Bottom 0.61: R3.1 157.8,103.5 157.8,111.12 158.43,112.08 C1.1 | R5.1 R4.1 R2.1 v38.1,90.17 | R1.1 v40.64,119.7 R6.1 R7.1
  Bottom 1.016: D2.A SV1.11 | v154.3,116.2 159.39,116.2 160.97,114.62 2D1.16 C1.1
B1
  Bottom 0.406: D56.C 72.07,99.7 70.17,100.33 70.17,104.78 70.48,105.09 70.48,107 70.8,107.31 70.8,110.81 | 78.1,127 80.96,125.1 86.36,125.1 89.54,127 | 70.37,127 68.9,126.36 D50.C | 97.47,127 100.01,125.1 105.73,125.1 108.7,127.43 | 139.07,127.32 136.21,125.1
  Bottom 0.61: 108.7,127.43 118.11,127.43 D52.C 122.55,119.38 132.08,119.38 132.51,119.81 D64B.C 136.21,122.03 136.21,125.1 | 70.8,110.81 64.77,113.98 | J44.1 149.95,126.36 149,127.32 139.07,127.32 | 70.37,127 78.1,127 | 89.54,127 97.47,127
  Bottom 0.813: D50.C 64.77,123.3 D49.C
  Bottom 1.016: 64.77,113.98 64.77,123.3
B2
  Bottom 0.61: J10.2 D58.C | 109.22,109.11 109.22,100.65 | J2.2 109.54,110.49 109.22,110.17
  Bottom 0.813: 109.22,109.11 109.22,110.17 104.78,114.62 100.65,114.62 99.38,113.35 D51.C
  Bottom 1.016: D58.C 99.7,100.65 109.22,100.65 109.85,100.65 111.96,97.59 D59.C
B2J
  Bottom 0.61: 62.75,84.14 66.36,84.14 68.58,86.36 73.98,86.36 77.47,88.26 77.47,91.76 79.69,96.2 79.69,98.74 81.28,100.65 90.17,100.65 91.76,98.42 J10.1
  Bottom 0.813: 62.75,84.14 60.64,86.36 D55.C
B3
  Bottom 0.61: D57.C 83.18,81.28 81.17,81.28 D63.C 74.82,76.95 71.12,81.92 62.23,81.92 58.42,76.2 55.56,76.2 52.5,81.48 42.75,81.48 39.05,77.15 37.15,77.15 34.29,80.96 33.34,81.6 29.21,81.6 | D47.C 22.02,79.17 24.45,81.6 29.21,81.6 | D54.C 29.21,81.6
  Bottom 1.016: D57.C J3.2
B3J
  Bottom 0.61: J46.1 148.68,88.04 145.73,84.14 141.45,84.14 135.26,77.63 D67B.C 131.13,76.63 | D66.C 131.13,69.74 131.13,76.63 | 131.13,76.63 131.13,78.12 127.64,82.55 120.01,82.55 115.89,86.68 112.62,86.68 J4.1
B4
  Bottom 0.61: D74.C 111.96,59.48 108.59,62.87 108.38,63.07 108.38,63.18 108.38,66.38 J50.1
  Bottom 0.813: 99.06,61.37 100.24,62.55 107.31,62.55 108.59,62.87 | D65.C 108.38,63.18
  Bottom 1.016: J5.1 99.06,61.37
B4J
  Bottom 0.61: J5.2 92.48,59.92 88.26,64.14 D64.C 85.52,62.23 80.65,62.23 77.47,59.06 D71.C 75.14,58.85 69.21,64.77 62.55,64.77 59.69,67.63 56.51,67.63 54.61,66.04 J11.2
B4J2
  Bottom 0.61: J11.1 48.03,64.77 45.08,64.77 38.74,58.42 37.58,58.42 D61.C 31.86,63.29 31.11,63.18 28.26,63.18 D53.C
B5
  Bottom 0.61: D67.C 111.96,40.43 109.22,43.18 107,43.18 | 107,43.18 101.92,43.18 100.65,44.13 | J48.1 107.09,43.27 107,43.18
  Bottom 1.016: J6.1 96.27,39.28 100.65,44.13 D73.C
B5J
  Bottom 0.61: J6.2 93.27,40.19 90.28,43.18 80.65,43.18 | 80.65,43.18 78.1,40.64 75.25,40.64 70.48,45.72 61.75,45.72 58.9,48.9 55.72,48.9 | 80.65,43.18 D72.C | D62.C 50.41,62.62 52.71,61.59 55.56,58.1 55.88,57.78 55.72,48.9 | 55.72,48.9 52.55,45.4 43.5,45.4 42.86,46.04 40.43,48.15 D69.C 36.4,48.78 33.65,46.04 D60.C
B6
  Bottom 0.61: J53.1 112.8,20.87 111.96,25.51 D81.C | D79.C 83.7,24.33 J12.2
  Bottom 1.016: D81.C D80.C 109.01,25.83 107.95,24.76 104.78,24.76 96.2,20.96 91.44,20.96 91.55,24.33 D79.C
B6J2
  Bottom 0.61: J12.1 74.61,34.52 74.61,39.37 70.59,43.71 62.12,43.71 59.06,39.69 57.47,39.69 | 57.47,39.69 55.25,39.69 52.3,43.59 D70.C | 57.47,39.69 57.47,33.34 54.93,30.16 51.03,29.21 J14.2
B6J3
  Bottom 0.61: J14.1 40.09,29.85 36.51,29.85 34.29,27.3 32.39,27.3 D68.C
B7
  Bottom 0.61: J9.1 71.98,14.69 73.66,11.75 75.88,11.75 77.15,10.79 77.15,8.57 82.03,7.19 87.2,7.19 88.26,9.21 90.28,9.21 D84.C 93.98,9.73 103.71,5.72 113.46,5.72 115.57,11 D85.C 119.38,10.79 127.95,7.3 137.48,7.3 137.16,9.52 140.02,9.52 148.59,5.72 162.56,5.72 164.78,7.94 164.78,16.83 163.83,17.78 163.83,21.59 162.24,24.76 162.56,50.8 162.56,85.73 165.73,88.58 165.73,100.97 163.51,103.19 162.88,104.46 161.92,105.41 2D1.13
B7J
  Bottom 0.61: D75.C 20.84,29 25.08,24.76 32.82,24.76 D76.C 33.34,23.18 32.7,20.64 51.75,20.64 59.69,25.4 D78.C 60.53,25.4 68.9,25.4 70.89,23.09 71.76,21.27 J9.2
B8
  Bottom 0.61: 2D1.12 162.24,102.23 164.15,100.33 164.15,90.81 160.97,87.63 160.97,60.96 161.29,59.06 161.29,55.88 160.66,54.93 160.66,49.85 161.29,48.58 161.29,43.5 160.02,37.15 160.02,24.45 161.29,21.91 161.29,17.78 162.24,16.83 162.24,13.45 D86.C 161.72,7.73 161.29,7.3 149.54,7.3 141.06,11.02 J8.2
BD1
  Bottom 0.406: SV1.10 28.26,105.73 29.21,106.36 32.07,106.36 32.39,105.73 34.61,104.46 35.88,105.41 45.56,105.41 46.35,104.78 51.28,104.78 52.07,103.98 54.13,103.98 56.2,105.73 58.9,105.73 | 61.91,103.19 66.45,103.19 J29.2
  Bottom 0.61: 61.91,103.19 58.9,105.73
BD2
  Bottom 0.406: SV1.9 25.72,105.73 28.57,107.31 30.16,107.31 32.7,109.54 33.34,109.54 36.51,106.36 54.93,106.36 55.56,107 59.53,107 62.39,104.46 66.67,104.46 67.79,105.57 J30.2
BD3
  Bottom 0.406: SV1.8 23.18,106.36 24.45,107.31 26.03,107.31 28.26,108.27 29.85,108.27 32.39,110.49 33.65,110.49 36.83,107.31 54.29,107.31 55.25,108.27 60.01,108.27 | 63.02,105.57 65.72,105.57 67.15,106.52 J31.2
  Bottom 0.61: 63.02,105.57 60.01,108.27
G1
  Bottom 0.61: JA49.2 47.94,120.52 47.94,122.87 45.72,122.87 45.08,122.71 43.5,122.71 42.86,123.83 R1.2 40.32,123.83 38.42,123.83 37.46,125.1 34.93,125.1 33.34,128.27
  Bottom 0.813: JA49.2 48.13,114.11 50.48,111.12 2D2.9 | JA47.2 1.59,112.52 1.59,99.38 2.41,98.11
  Bottom 1.016: JA47.2 2.41,126.29 6.98,128.27 15.24,128.27 19.05,124.46 | 2.41,98.23 2.41,98.11 JA53.2 JA60.2 JA68.2 JA75.2 2.41,27.75 3.49,26.67 7.3,26.67 11.43,24.45 12.7,23.18 14.29,23.18 15.24,19.37 15.24,11.94 JA82.2 | 19.05,124.46 JA48.2 | 33.34,128.27 22.86,128.27 19.05,124.46
G2
  Bottom 0.61: JA56.2 56.2,89.22 53.02,86.36 JA55.2 49.53,85.09 49.53,82.87 43.34,82.87 39.05,87.63 35.56,87.63 | JA70.2 39.56,50.93 36.83,50.93 32.89,47.94 31.75,47.94 | 23.18,83.38 22.86,81.92 20.32,79.06 20.32,72.71 21.46,71.25 JA61.2 21.3,68.87 22.86,66.67 25.72,64.77 25.72,62.55 22.54,61.59 22.54,57.15 20.96,55.88 20.96,52.71 21.46,52.2 JA69.2 21.46,49.34 25.08,45.72 26.99,45.72 29.21,47.94 31.75,47.94 | 23.18,83.38 JA54.2 | 31.75,47.94 31.75,44.13 33.97,42.23 40,37.15 40,34.29 JA77.2 JA76.2 | 35.56,87.63 35.24,85.73 33.97,84.45 31.94,83.38 23.18,83.38 | J22.2 R2.2 35.56,90.49 35.56,87.63
G3
  Bottom 0.61: JA71.2 59.56,56.01 53.34,62.87 51.43,64.14 51.43,66.99 52.71,67.31 53.96,67.31 55.98,69.33
  Bottom 1.016: J15.2 JA62.2 | JA62.2 JA63.2 | 55.98,69.33 JA62.2
G4
  Bottom 0.406: J34.2 73.34,99.7 74.93,98.11 77.79,98.11 80.96,102.23
  Bottom 0.61: JA64.2 94.11,77.34 89.22,82.87 89.22,85.41 91.44,87 93.79,88.39 JA57.2 93.98,97.15 91.12,101.6 90.49,102.23 | JA72.2 93.98,60.33 91.12,63.18 91.12,65.4 | JA79.2 94.74,40.51 90.49,44.77 90.49,46.36 | JA87.2 70.61,20.64 | 70.61,20.64 70.61,20.83 70.99,25.38 69.72,27.73 JA78.2 | 80.96,102.23 90.49,102.23 | JA51.2 86.23,112.52 87.95,110.81 89.54,110.81 90.17,110.17 90.17,102.55 90.49,102.23 | 90.96,26.04 84.14,26.04 82.87,26.99 80.65,24.76 80.65,23.5 74.61,20.64 70.61,20.64
  Bottom 0.813: 90.96,26.04 94.74,31.24
  Bottom 1.016: JA51.2 JA50.2 | JA64.2 94.11,68.71 91.12,65.4 | JA72.2 94.11,49.97 90.49,46.36 | 94.74,31.24 JA79.2
G5
  Bottom 0.61: 113.67,32.26 113.67,25.72 117.6,21.15 JA84.2 114.43,12.19 113.03,7.62 104.14,7.62 95.89,11.43 93.34,11.43 92.2,12.57 JA83.2 | JA80.2 113.79,40.51 108.59,45.4 108.59,47.62 109.22,48.26 110.49,48.9 112.84,49.97 JA73.2 113.16,54.1 113.79,54.74 113.79,59.56 109.85,63.5 109.85,65.4 112.52,67.12 114.11,67.44 JA65.2 | 107.95,86.36 110.49,86.36 113.63,89.98 113.63,95.44 119.06,99.7 121.6,102.23 121.6,113.03 | 107.95,86.36 106.17,86.36 JA58.2 | 114.11,76.71 109.98,81.15 107.95,81.28 107.95,86.36 | J21.2 123.82,115.25 121.6,113.03 | 121.6,113.03 JA52.2
  Bottom 1.016: JA66.2 JA65.2 114.11,76.71 | 113.67,32.26 JA80.2
G6
  Bottom 0.406: 139.07,128.91 131.76,123.19
  Bottom 0.61: 156.21,39.05 156.21,39.37 151.76,43.82 | 141.16,13.34 141.27,13.29 141.29,19.37 149.86,26.35 151.76,26.35 | JB74.1 144.59,44.29 | 156.21,67.95 156.21,88.58 155.26,89.53 152.4,89.53 151.76,90.17 148.91,90.17 148.27,89.53 JA59.2 142.37,91.95 140.65,93.66 140.65,109.22 JA74B.2 147.32,112.27 151.45,116.4 151.45,127.64 150.18,128.91 139.07,128.91 | 151.76,26.35 JA81.2 | 151.76,26.35 153.67,26.35 156.21,28.89 156.21,30.16 | 131.76,123.19 J17.2 | JA67B1.2 144.46,63.5 147.95,63.5 | 147.95,61.28 146.69,60.01 145.1,60.01 144.59,59.5 144.59,58.23
  Bottom 0.813: 151.76,43.82 144.59,43.82 144.59,44.29 | 156.21,39.05 156.21,30.16 | 156.21,67.95 154.18,65.91 JA67B.2 | 147.95,63.5 147.95,61.28 | 144.59,58.23 144.59,57.59
  Bottom 1.016: 144.59,43.82 141.13,43.82 133.48,34.26 JA67.2 | JA85.2 141.16,13.34 | 141.27,13.29 JA86.2 | JB74.1 144.59,57.59 | 147.95,63.5 JA67B.2
GG5
  Bottom 0.61: 2D2.11 45.08,110.49 45.08,113.35 44.45,113.98 44.45,117.16 R6.2 J19.1
GND_B
  Top 0.61: 53.02,105.41 2D2.7 | 2D1.4 | SV1.1 5.4,100.33 35.24,100.33 C2.2 38.42,105.41 53.02,105.41 | 53.02,105.41 54.29,105.41 54.29,106.04 60.64,106.04 60.64,104.78 72.71,104.78 72.71,106.04 79.69,106.04 79.69,104.78 92.39,104.78 92.39,107 98.42,107 98.42,104.78 110.81,104.78 110.81,106.04 117.79,106.04 117.79,104.78 150.18,104.78 150.18,102.87 2D1.5
  Bottom 0.61: 2D1.5 151.13,102.87 149.86,101.6 149.86,95.89 150.49,95.25 2D1.8 | C1.2 156.53,107 154.94,105.41 2D1.4
  Bottom 1.016: 2D1.4 2D1.5
N$1
  Bottom 1.016: 2D2.1 J22.1
N$2
  Bottom 0.406: SV1.4 13.02,106.36 14.29,107.63 23.18,107.63 24.45,108.59 26.03,108.59 28.26,109.54 29.53,109.54 31.75,111.76 33.65,111.76 36.2,112.08 J23.1
N$3
  Bottom 0.61: 2D2.10 J25.2
N$4
  Bottom 0.406: SV1.3 10.48,106.36 12.7,108.59 21.59,108.59 22.86,109.54 25.4,109.54 27.62,110.49 29.21,110.49 29.85,111.44 31.11,112.71 33.74,112.71 J24.1
N$5
  Bottom 1.016: J24.2 42.63,113.35 J25.1
N$6
  Bottom 1.016: J26.2 J27.1
N$7
  Bottom 0.406: J26.1 36.51,115.57 33.65,113.67 30.16,113.67 27.94,111.44 27.31,111.44 24.76,110.49 21.91,110.49 20.96,109.86 11.75,109.86 7.94,106.04 SV1.2
N$8
  Bottom 0.61: J27.2 46.67,117.48 46.67,118.43 J28.1
N$9  (via drill 3 pad 5)
  other vias: 120.65,3.17
N$10
  Bottom 1.016: D1.A D2.C
N$11
  Bottom 0.406: J29.1 73.47,104.91 74.61,106.04 78.1,106.04 80.96,103.82 81.6,103.51 88.35,103.51 J1.2
N$12
  Bottom 0.406: J32.2 87.31,106.04 86.04,104.78 81.6,104.78 78.29,107.45 74.2,107.45 J30.1
N$13
  Bottom 0.406: J33.2 87.63,108.27 85.41,106.04 81.92,106.04 78.61,108.72 73.7,108.72 J31.1
N$14
  Bottom 0.61: J1.1 93.26,104.78 97.15,104.78 100.01,102.23 106.13,102.23 J35.2
N$15
  Bottom 0.61: J32.1 98.11,106.04 100.96,103.51 104.46,103.51 107,106.04 J36.2
N$16
  Bottom 0.61: J33.1 93.03,108.27 93.98,107.63 98.74,107.63 101.6,105.09 103.82,105.09 107,108.27 J37.2
N$17
  Bottom 0.61: J13.2 141.52,62 136.33,67.18 JB67B.2
N$18
  Bottom 0.61: J38.2 J37.1
N$19
  Bottom 0.61: J40.2 119.06,106.04 118.11,107 113.03,107 112.08,106.04 J36.1
N$20
  Bottom 0.61: J39.2 119.06,103.82 117.48,105.41 113.35,105.41 112.08,104.46 J35.1
N$21
  Bottom 0.61: 127.64,108.27 131.13,104.78 135.57,104.78 138.11,107.31 J41.2
  Bottom 0.813: 127.64,108.27 J38.1
N$22
  Bottom 0.61: 126.05,106.04 129.86,102.23 136.21,102.23 138.11,104.78 J42.2
  Bottom 0.813: 126.05,106.04 J40.1
N$23
  Bottom 0.61: 124.78,103.82 127.95,100.33 136.61,100.33 J43.2
  Bottom 0.813: 124.78,103.82 J39.1
N$24
  Bottom 0.61: J41.1 145.73,107.95 150.81,113.03 2D1.1
N$25
  Bottom 0.61: J42.1 146.69,105.41 151.76,110.49 2D1.2
N$26
  Bottom 0.61: J43.1 147,102.87 152.08,107.95 2D1.3
N$27
  Bottom 0.61: J44.2 157.16,123.1 163.2,116.84 163.2,111.76 2D1.15
N$28
  Bottom 1.016: S86.SW1 JB86.2
N$29
  Bottom 1.016: S86.SW2 JA86.1
N$30  (via drill 1 pad 2)
  other vias: 114.62,101.28
N$31  (via drill 3 pad 5)
  other vias: 166.37,131.44
N$32
  Bottom 0.61: J46.2 150.81,92.71 151.45,93.03 154.62,93.03 155.57,93.98 155.57,96.52 154.94,97.79 2D1.7
N$33
  Bottom 0.61: J51.1 140.33,46.04 134.94,39.05 132.08,39.05 128.59,43.82 121.6,43.82 115.57,48.9 113.98,48.9 111.12,46.99 J48.2
N$34
  Bottom 0.61: 2D1.9 160.97,90.81 159.39,89.22 159.39,65.72 153.04,59.37 153.04,45.08 158.11,39.53 158.11,27.62 154.62,24.13 149.86,24.13 147.55,21.18 144.37,18.73 J52.2
N$35
  Bottom 0.61: J49.2 155.49,91.03 157.16,93.03 157.16,98.11 159.7,100.33 2D1.11
N$36
  Bottom 0.61: J50.2 115.8,67.72 121.6,62.23 127.64,62.23 128.91,63.18 128.91,65.09 132.72,69.22 132.72,74.93 135.57,74.93 142.4,82.23 146.37,82.23 150.18,87 153.35,87 J49.1
N$37
  Bottom 0.61: 2D1.10 160.02,97.79 158.75,96.52 158.75,91.76 157.8,90.81 157.8,66.67 154.94,63.82 152.4,63.82 150.18,60.96 146.69,57.78 146.69,46.6 J51.2
N$38  (via drill 3 pad 5)
  other vias: 96.52,3.17
N$39
  Bottom 0.61: J53.2 121.29,19.05 126.84,21.43 126.84,24.29 131.76,29.53 135.26,29.53 138.75,26.04 138.75,20.09 J52.1
N$40  (via drill 3 pad 5)
  other vias: 144.78,3.17
N$41  (via drill 3 pad 5)
  other vias: 166.37,3.17
N$42  (via drill 3 pad 5)
  other vias: 19.05,3.17
N$43  (via drill 3 pad 5)
  other vias: 28.57,3.17
N$44  (via drill 3 pad 5)
  other vias: 53.34,3.17
N$45  (via drill 3 pad 5)
  other vias: 72.39,3.17
N$46  (via drill 3 pad 5)
  other vias: 64.77,131.44
N$47  (via drill 3 pad 5)
  other vias: 3.18,3.17
N$48  (via drill 3 pad 5)
  other vias: 3.18,131.44
N$49  (via drill 3 pad 5)
  other vias: 19.05,131.44
N$50  (via drill 3 pad 5)
  other vias: 134.62,131.44
N$51
  Bottom 1.27: JA67B.1 S67C.SW1
N$52  (via drill 3 pad 5)
  other vias: 41.91,131.44
N$53  (via drill 3 pad 5)
  other vias: 83.82,131.44
N$54  (via drill 3 pad 5)
  other vias: 102.87,131.44
N$55
  Bottom 0.813: J7.2 126.05,113.44 J2.1
N$56  (via drill 1 pad 2)
  other vias: 19.05,113.35
N$57  (via drill 1 pad 2)
  other vias: 19.05,83.66
N$58  (via drill 1 pad 2)
  other vias: 18.73,63.18
N$59  (via drill 1 pad 2)
  other vias: 19.05,44.45
N$60
  Bottom 1.27: JA67B1.1 S67B.SW2
N$61  (via drill 1 pad 2)
  other vias: 38.1,63.5
N$62  (via drill 1 pad 2)
  other vias: 38.1,82.55
N$63  (via drill 1 pad 2)
  other vias: 58.1,82.87
N$64  (via drill 1 pad 2)
  other vias: 58.1,63.5
N$65  (via drill 1 pad 2)
  other vias: 53.34,25.4
N$66  (via drill 1 pad 2)
  other vias: 38.1,44.45
N$67
  Bottom 0.406: SV1.7 20.64,102.87 21.59,101.92 34.29,101.92 35.88,104.46 44.77,104.46 45.72,103.66 49.69,103.66 2D2.6
N$68  (via drill 1 pad 2)
  other vias: 18.73,24.76
N$69  (via drill 1 pad 2)
  other vias: 38.1,25.4
N$70
  Bottom 1.422: JB74B.2 S74.SW2
N$71
  Bottom 1.422: JB52.2 S52.SW1
N$72  (via drill 1 pad 2)
  other vias: 75.56,25.72
N$73  (via drill 1 pad 2)
  other vias: 57.15,44.45
N$74  (via drill 1 pad 2)
  other vias: 76.04,45.72
N$75  (via drill 1 pad 2)
  other vias: 96.2,25.4
N$76  (via drill 1 pad 2)
  other vias: 95.25,44.45
N$77  (via drill 1 pad 2)
  other vias: 120.97,25.4
N$78  (via drill 1 pad 2)
  other vias: 143.51,25.08
N$79  (via drill 1 pad 2)
  other vias: 133.35,25.4
N$80  (via drill 1 pad 2)
  other vias: 157.16,57.78
N$81  (via drill 1 pad 2)
  other vias: 157.16,46.67
N$82  (via drill 1 pad 2)
  other vias: 133.98,44.45
N$83  (via drill 1 pad 2)
  other vias: 133.35,63.5
N$84
  Bottom 1.016: S63.SW1 JB63.2
N$85  (via drill 1 pad 2)
  other vias: 114.3,44.45
N$86  (via drill 1 pad 2)
  other vias: 114.3,63.5
N$87  (via drill 1 pad 2)
  other vias: 95.25,63.5
N$88  (via drill 1 pad 2)
  other vias: 76.2,63.5
N$89
  Bottom 1.016: JB73.2 S73.SW2
N$90  (via drill 1 pad 2)
  other vias: 76.2,82.55
N$91  (via drill 1 pad 2)
  other vias: 133.98,109.22
N$92  (via drill 1 pad 2)
  other vias: 95.25,82.55
N$93  (via drill 1 pad 2)
  other vias: 114.3,82.55
N$94
  Bottom 1.27: S74A.SW1 JB74.2
N$95  (via drill 1 pad 2)
  other vias: 152.08,82.87
N$96  (via drill 1 pad 2)
  other vias: 133.51,82.39
N$97
  Bottom 1.016: S74A.SW2 JA74.1
N$98  (via drill 1 pad 2)
  other vias: 102.71,109.54
N$99  (via drill 1 pad 2)
  other vias: 95.57,101.12
N$100  (via drill 1 pad 2)
  other vias: 83.82,109.38
N$101  (via drill 1 pad 2)
  other vias: 76.2,102.08
N$102  (via drill 1 pad 2)
  other vias: 57.79,101.44
N$112
  Bottom 1.016: JB47.2 S47.SW1
N$127
  Bottom 1.016: JB53.2 S53.SW1
N$152
  Bottom 0.406: 77.79,130.17 81.92,127 85.73,127 89.85,130.17 | 70.8,130.17 66.36,127 62.55,127 59.37,129.22 | 97.15,130.17 100.65,127 104.78,127 108.59,130.17
  Bottom 0.61: J18.2 40.32,125.41 41.28,126.05 46.35,126.05 49.85,129.22 59.37,129.22 | 77.79,130.17 70.8,130.17 | 89.85,130.17 97.15,130.17 | 108.59,130.17 108.9,130.49 121.37,130.49 J17.1
N$153
  Bottom 1.016: S60.SW1 JB60.2
N$154
  Bottom 1.016: JB68.2 S68.SW1
N$155
  Bottom 1.016: JB75.2 S75.SW1
N$156
  Bottom 1.016: JB82.2 S82.SW1
N$157
  Bottom 1.016: S48.SW1 34.61,116.2 36.51,118.11 JB48.2
N$158
  Bottom 1.016: JB54.2 S54.SW1
N$159
  Bottom 1.016: JB61.2 S61.SW1
N$160
  Bottom 1.016: S69.SW1 35.24,52.07 JB69.2
N$161
  Bottom 1.016: S76.SW2 JB76.2
N$162
  Bottom 1.016: S83.SW2 JB83.2
N$163
  Bottom 1.016: S49.SW1 JB49.2
N$164
  Bottom 1.016: S55.SW1 54.48,90.17 JB55.2
N$165
  Bottom 1.016: JB62.2 S62.SW2
N$166
  Bottom 1.016: JB70.2 S70.SW1
N$167
  Bottom 1.016: JB77.2 S77.SW1
N$168
  Bottom 1.016: JA73.1 S73.SW1
N$169
  Bottom 1.422: JB50.2 S50.SW2
N$170
  Bottom 1.016: S56.SW1 JB56.2
N$171
  Bottom 1.016: S71.SW1 JB71.2
N$172
  Bottom 1.016: JB78.2 S78.SW2
N$173
  Bottom 1.016: JB85.2 S85.SW2
N$174
  Bottom 1.016: JB51.2 S51.SW1
N$175
  Bottom 1.016: JB57.2 S57.SW2
N$176
  Bottom 1.016: S57.SW1 JA57.1
N$177
  Bottom 1.016: S64.SW1 JA64.1
N$178
  Bottom 1.016: S79.SW2 JB79.2
N$180
  Bottom 1.016: JB58.2 S58.SW2
N$181
  Bottom 1.016: JB65.2 S65.SW2
N$182
  Bottom 1.016: S80.SW1 JA80.1
N$183  (1 unrouted)
N$184
  Bottom 1.016: S66.SW1 JB66.2
N$185
  Bottom 1.016: JB67.2 S67.SW2
N$186  (1 unrouted)
  Bottom 1.27: S81.SW2 JB81.2
N$187
  Bottom 0.61: JB47.1 8.38,109.86 5.71,109.86 3.18,107 3.18,102.23 4.44,100.97 13.65,100.97 17.14,97.79 17.14,87.31 14.45,84.93 14.45,82.71 16.83,80.17 D47.A
N$188
  Bottom 0.61: JB53.1 12.22,83.03 15.56,79.69 15.56,75.88 17.78,73.66 17.78,70.37 21.91,65.72 D53.A
N$189
  Bottom 0.61: JB60.1 13.34,63.18 18.41,57.15 18.41,50.48 24.76,44.13 28.46,44.13 D60.A
N$190
  Bottom 0.61: JB68.1 13.34,44.45 17.78,40 17.78,33.97 25.08,26.67 D68.A
N$191
  Bottom 1.016: D75.A 12.05,26.56 JB75.1
N$192
  Bottom 1.016: JB82.1 D82.A
N$193
  Bottom 1.27: D48.A JB48.1
N$194
  Bottom 0.61: JB54.1 D54.A
N$195
  Bottom 0.61: JB61.1 D61.A
N$196
  Bottom 0.61: JB69.1 D69.A
N$197
  Bottom 0.61: JB76.1 D76.A
N$198
  Bottom 0.61: D83.A JB83.1
N$199
  Bottom 0.813: JB49.1 62.67,119.14 D49.A
N$200
  Bottom 1.016: JB55.1 D55.A
N$201
  Bottom 0.61: JB62.1 D62.A
N$202
  Bottom 0.61: JB70.1 D70.A
N$203
  Bottom 0.61: D77.A 46.35,25.91 JB77.1
N$204
  Bottom 0.61: JB84.1 96.09,13.34 D84.A
N$205
  Bottom 0.813: D50.A 66.99,118.62 JB50.1
N$206
  Bottom 1.016: JB56.1 75.37,91.63 D56.A
N$207
  Bottom 1.016: JB63.1 D63.A
N$208
  Bottom 1.016: JB71.1 D71.A
N$209
  Bottom 1.016: D78.A JB78.1
N$210
  Bottom 1.016: D85.A JB85.1
N$211
  Bottom 1.016: JB51.1 D51.A
N$212
  Bottom 1.016: JB57.1 79.41,86.85 D57.A
N$213
  Bottom 1.016: JB64.1 78.61,67.44 81.92,64.14 D64.A
N$214
  Bottom 1.016: JB72.1 D72.A
N$215
  Bottom 1.016: JB79.1 D79.A
N$216
  Bottom 0.61: JB86.1 D86.A
N$217
  Bottom 0.813: D52.A 120.97,116.4 JB52.1
N$218
  Bottom 1.016: D58.A 97.15,90.04 JB58.1
N$219
  Bottom 0.813: D65.A 101.08,64.45 97.66,67.87
  Bottom 1.016: JB65.1 97.66,67.87
N$220
  Bottom 0.61: JB73.1 D73.A
N$221
  Bottom 1.016: D80.A 104.46,26.67 103.19,26.67 JB80.1
N$222
  Bottom 0.61: JB59.1 118.11,87 115.68,89.11 D59.A
N$223
  Bottom 1.016: JB66.1 D66.A
N$224
  Bottom 1.016: JB67.1 D67.A
N$225
  Bottom 0.61: JA74.2 120.78,46.86 117.16,49.85 116.84,50.8 115.89,51.75 115.89,55.13 D74.A
N$226
  Bottom 0.61: D81.A 115.37,25.61 119.38,21.27 123.19,21.27 125.25,23.18 125.25,24.76 131.13,31.11 JB81.1
N$227
  Bottom 1.016: JA66.1 S66.SW2
N$228
  Bottom 1.016: JA47.1 S47.SW2
N$229
  Bottom 1.016: JA53.1 S53.SW2
N$230
  Bottom 1.016: JA60.1 S60.SW2
N$231
  Bottom 1.016: JA68.1 S68.SW2
N$232
  Bottom 1.016: JA75.1 S75.SW2
N$233
  Bottom 1.016: JA82.1 S82.SW2
N$234
  Bottom 1.016: S48.SW2 JA48.1
N$235
  Bottom 1.016: JA54.1 S54.SW2
N$236
  Bottom 1.016: JA61.1 24.45,69.85 S61.SW2
N$237
  Bottom 1.016: JA69.1 S69.SW2
N$238
  Bottom 1.016: S76.SW1 JA76.1
N$239
  Bottom 1.016: S83.SW1 JA83.1
N$240
  Bottom 1.016: S49.SW2 JA49.1
N$241
  Bottom 1.016: S55.SW2 JA55.1
N$242
  Bottom 1.016: S62.SW1 JA62.1
N$243
  Bottom 1.016: JA70.1 S70.SW2
N$244
  Bottom 1.016: JA77.1 S77.SW2
N$245
  Bottom 1.016: JB80.2 S80.SW2
N$246
  Bottom 1.016: S50.SW1 JA50.1
N$247
  Bottom 1.016: JA56.1 S56.SW2
N$248
  Bottom 1.016: JA63.1 S63.SW2
N$249
  Bottom 1.016: JA71.1 S71.SW2
N$250
  Bottom 1.016: S78.SW1 JA78.1
N$251
  Bottom 1.27: S85.SW1 JA85.1
N$252
  Bottom 1.016: JA51.1 S51.SW2
N$253
  Bottom 1.016: JB64.2 S64.SW2
N$254
  Bottom 1.016: JB72.2 81.79,50.45 S72.SW2
N$255
  Bottom 1.016: S72.SW1 JA72.1
N$256
  Bottom 1.016: S79.SW1 JA79.1
N$258
  Bottom 1.016: S52.SW2 JA52.1
N$259
  Bottom 1.016: S65.SW1 JA65.1
N$260
  Bottom 1.016: S58.SW1 JA58.1
N$261
  Bottom 1.016: JB84.2 S84.SW2
N$262
  Bottom 1.27: S84.SW1 JA84.1
N$263  (1 unrouted)
  Bottom 1.27: S81.SW1 JA81.1
N$264
  Bottom 1.27: S67.SW1 JA67.1
N$265  (1 unrouted)
N$266
  Bottom 0.61: 135.26,113.79 D64B.A
  Bottom 0.813: 135.26,113.79 JB74B.1
N$267
  Bottom 1.27: S74.SW1 JA74B.1
N$268
  Bottom 0.406: SV1.6 18.1,102.55 19.68,100.97 34.93,100.97 36.51,103.51 44.13,103.51 2D2.4
N$269
  Bottom 0.61: J4.2 100.33,83.18 97.15,86.68 93.66,86.68 92.07,85.09 J3.1
N$270
  Bottom 0.406: SV1.5 15.56,102.23 17.78,100.01 33.97,100.01 34.61,97.47 36.83,97.47 39.05,99.7
  Bottom 0.61: 39.05,99.7 2D2.2
N$271
  Bottom 0.813: S67C.SW2 J13.1
  Bottom 1.016: S67C.SW2 S67B.SW1
N$275
  Bottom 0.61: J23.2 42.23,110.4 2D2.12
N$277
  Bottom 1.016: 2D1.6 R3.2
N$278  (via drill 3 pad 5)
  other vias: 166.37,82.55
N$279  (via drill 3 pad 5)
  other vias: 166.37,63.5
N$281
  Bottom 0.61: J28.2 52.07,120.33 52.71,116.84 55.56,115.25 55.56,111.76 2D2.8
N$282
  Bottom 1.016: D67B.A JB67B.1
N$283  (via drill 3 pad 5)
  other vias: 166.37,44.45
N$284  (via drill 3 pad 5)
  other vias: 166.37,25.4
N$285
  Bottom 0.61: J15.1 55.97,78.33 53.34,82.87 51.75,82.87 J16.2
N$286
  Bottom 1.016: S87.SW1 JA87.1
N$287
  Bottom 1.016: S87.SW2 JB87.2
N$288
  Bottom 1.016: JB87.1 D87.A
N$454  (via drill 3 pad 5)
  other vias: 166.37,105.41
N$477  (via drill 1 pad 2)
  other vias: 64.61,109.54
PG3
  Bottom 0.406: 2D2.3 40,98.11 39.69,97.47 39.69,95.57 R4.2
  Bottom 0.61: R4.2 40,93.03 40.64,89.22 41.91,86.36 43.82,84.14 J16.1
PG4
  Bottom 0.406: J34.1 67.31,100.33 61.91,100.33 60.01,97.47 54.93,97.47 52.71,100.01 48.89,100.01 2D2.5 46.99,100.01 42.86,100.01 41.91,99.06 R5.2
PG5
  Bottom 0.406: 77.79,128.59 81.6,126.05 86.04,126.05 89.85,128.59 | 70.48,128.59 66.67,126.05 61.91,126.05 59.06,127.64 | 97.15,128.59 100.33,126.05 105.09,126.05 108.59,128.91
  Bottom 0.61: 97.15,128.59 89.85,128.59 | J19.2 46.58,124.05 50.8,127.64 59.06,127.64 | 77.79,128.59 70.48,128.59 | 108.59,128.91 119.93,128.91 121.83,123.83 J21.1
PG6
  Bottom 0.61: 2D2.13 39.37,110.81 39.37,117.48 | 39.37,117.48 38.42,118.11 38.42,120.97 J18.1 | 39.37,117.48 R7.2

### Text on the board
Bottom: 1177-16